# EAGLE design badge2016 (EAGLE 7.5.0)
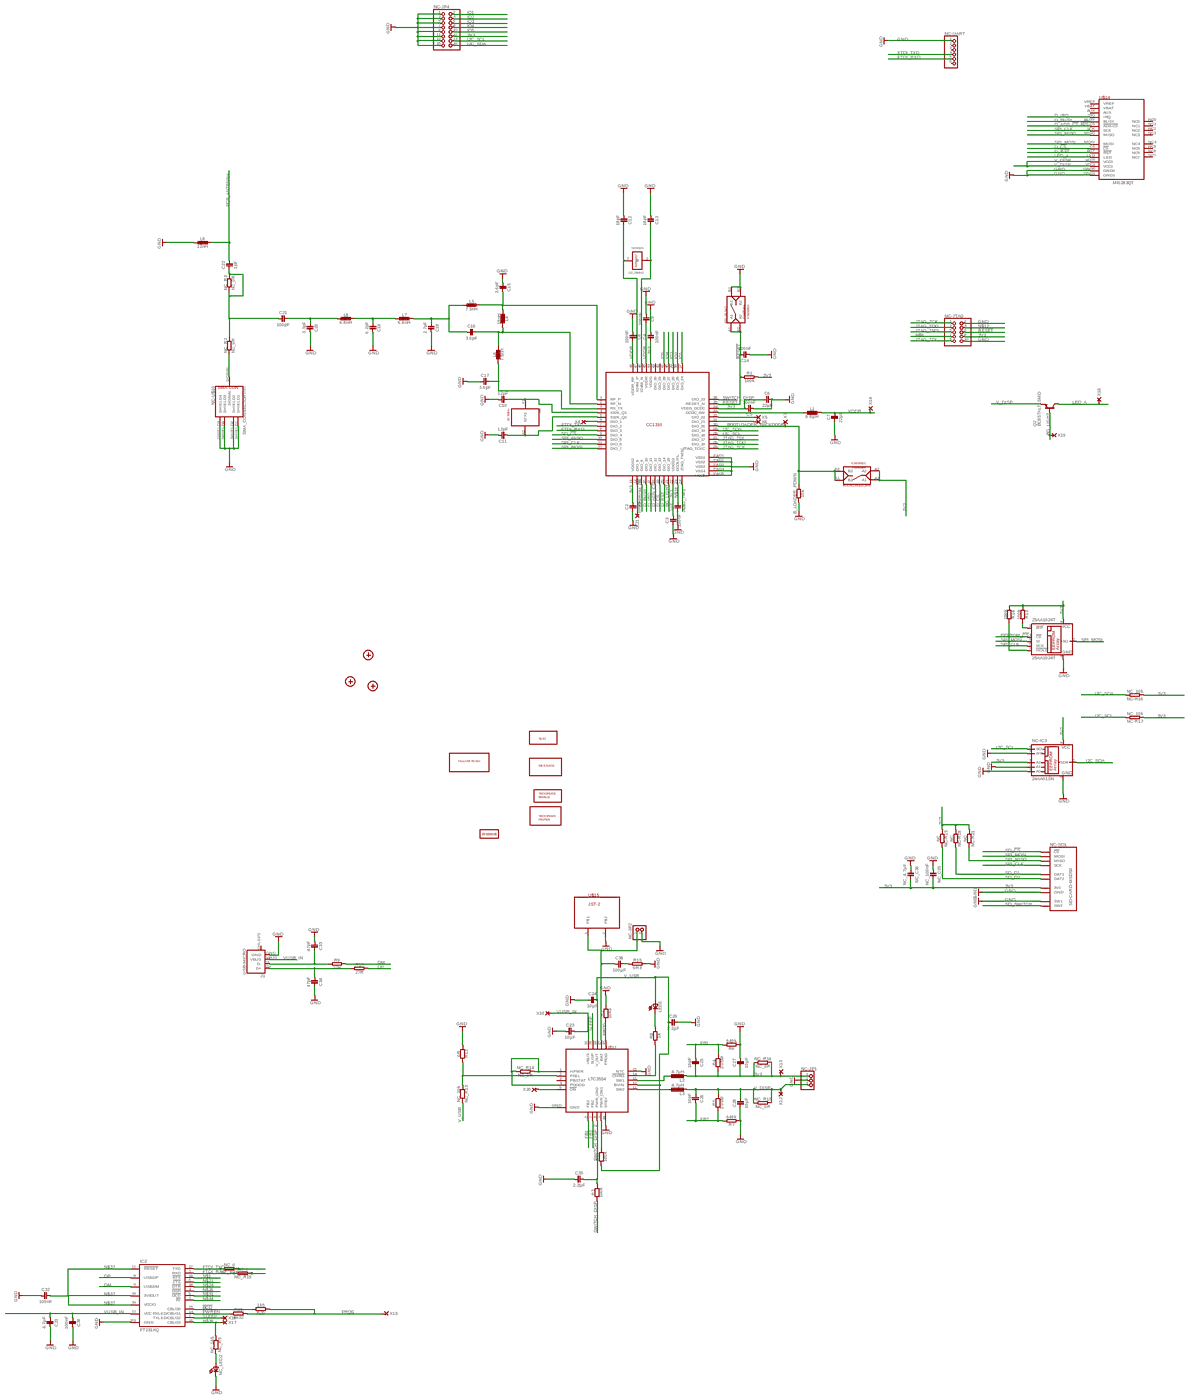
[diagram p0: schematic, sheet 1, overview]
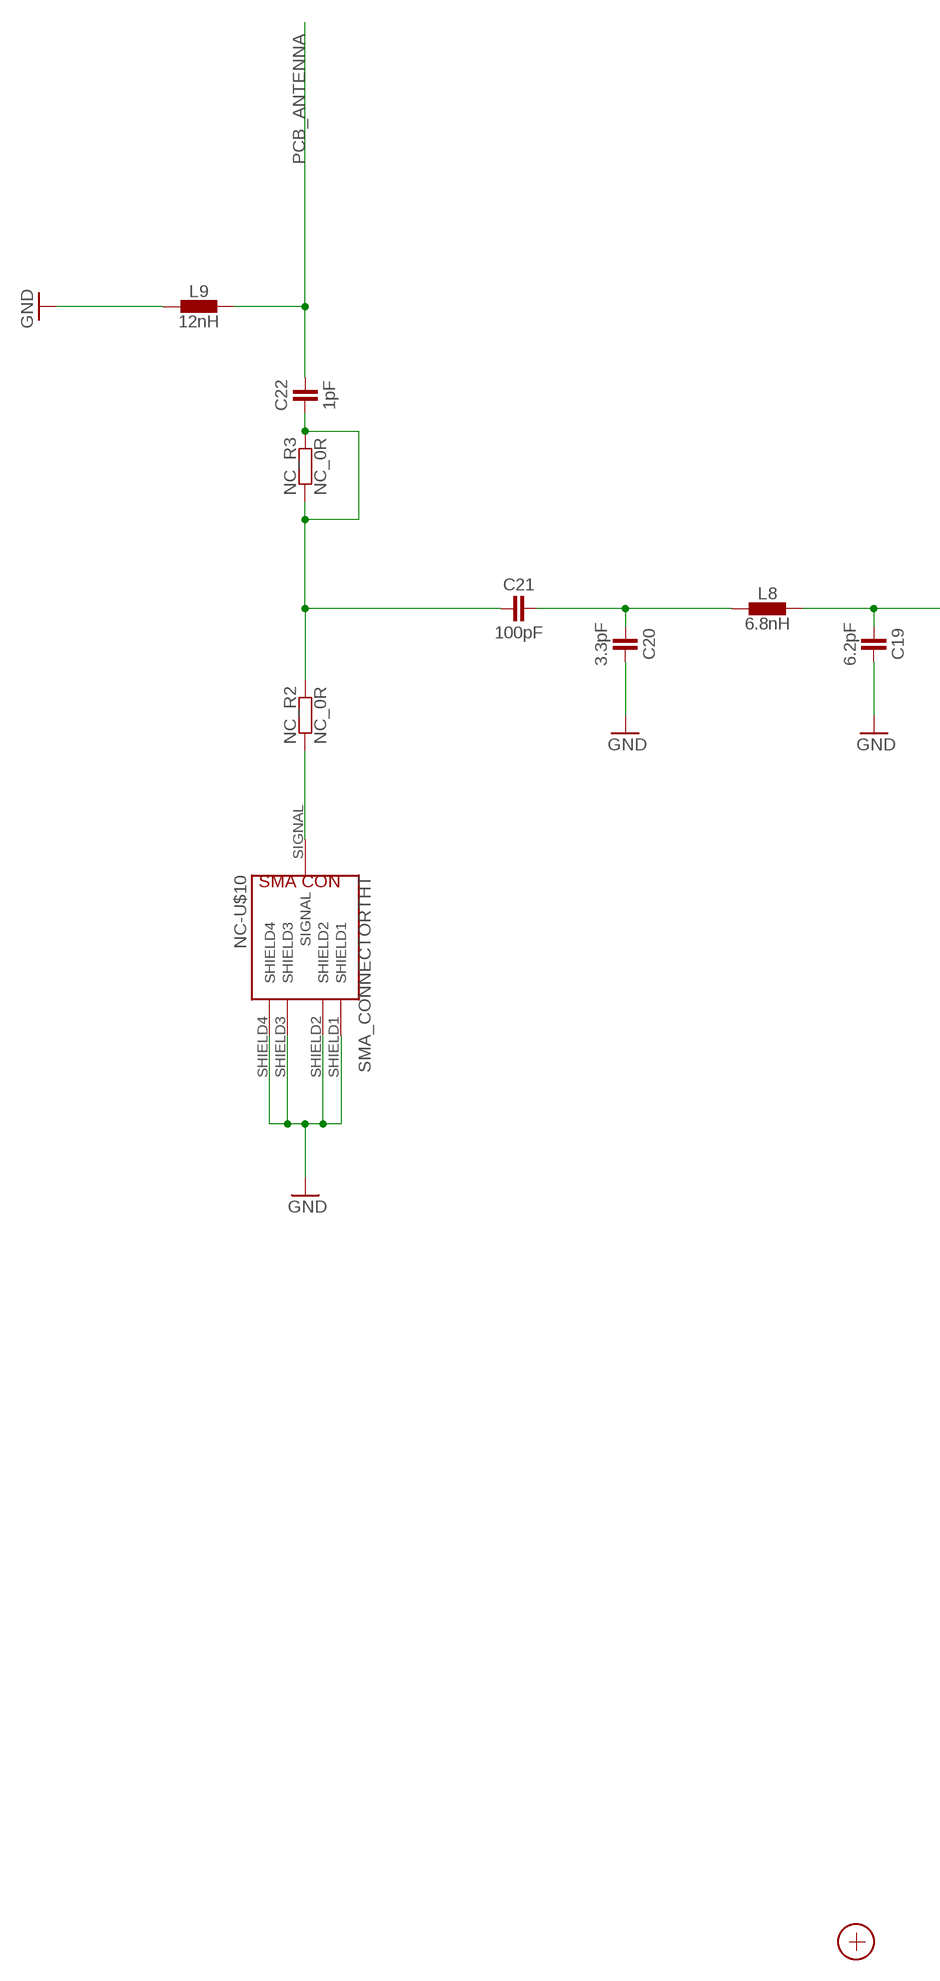
[diagram p1: schematic, sheet 1, part 1 of 4]
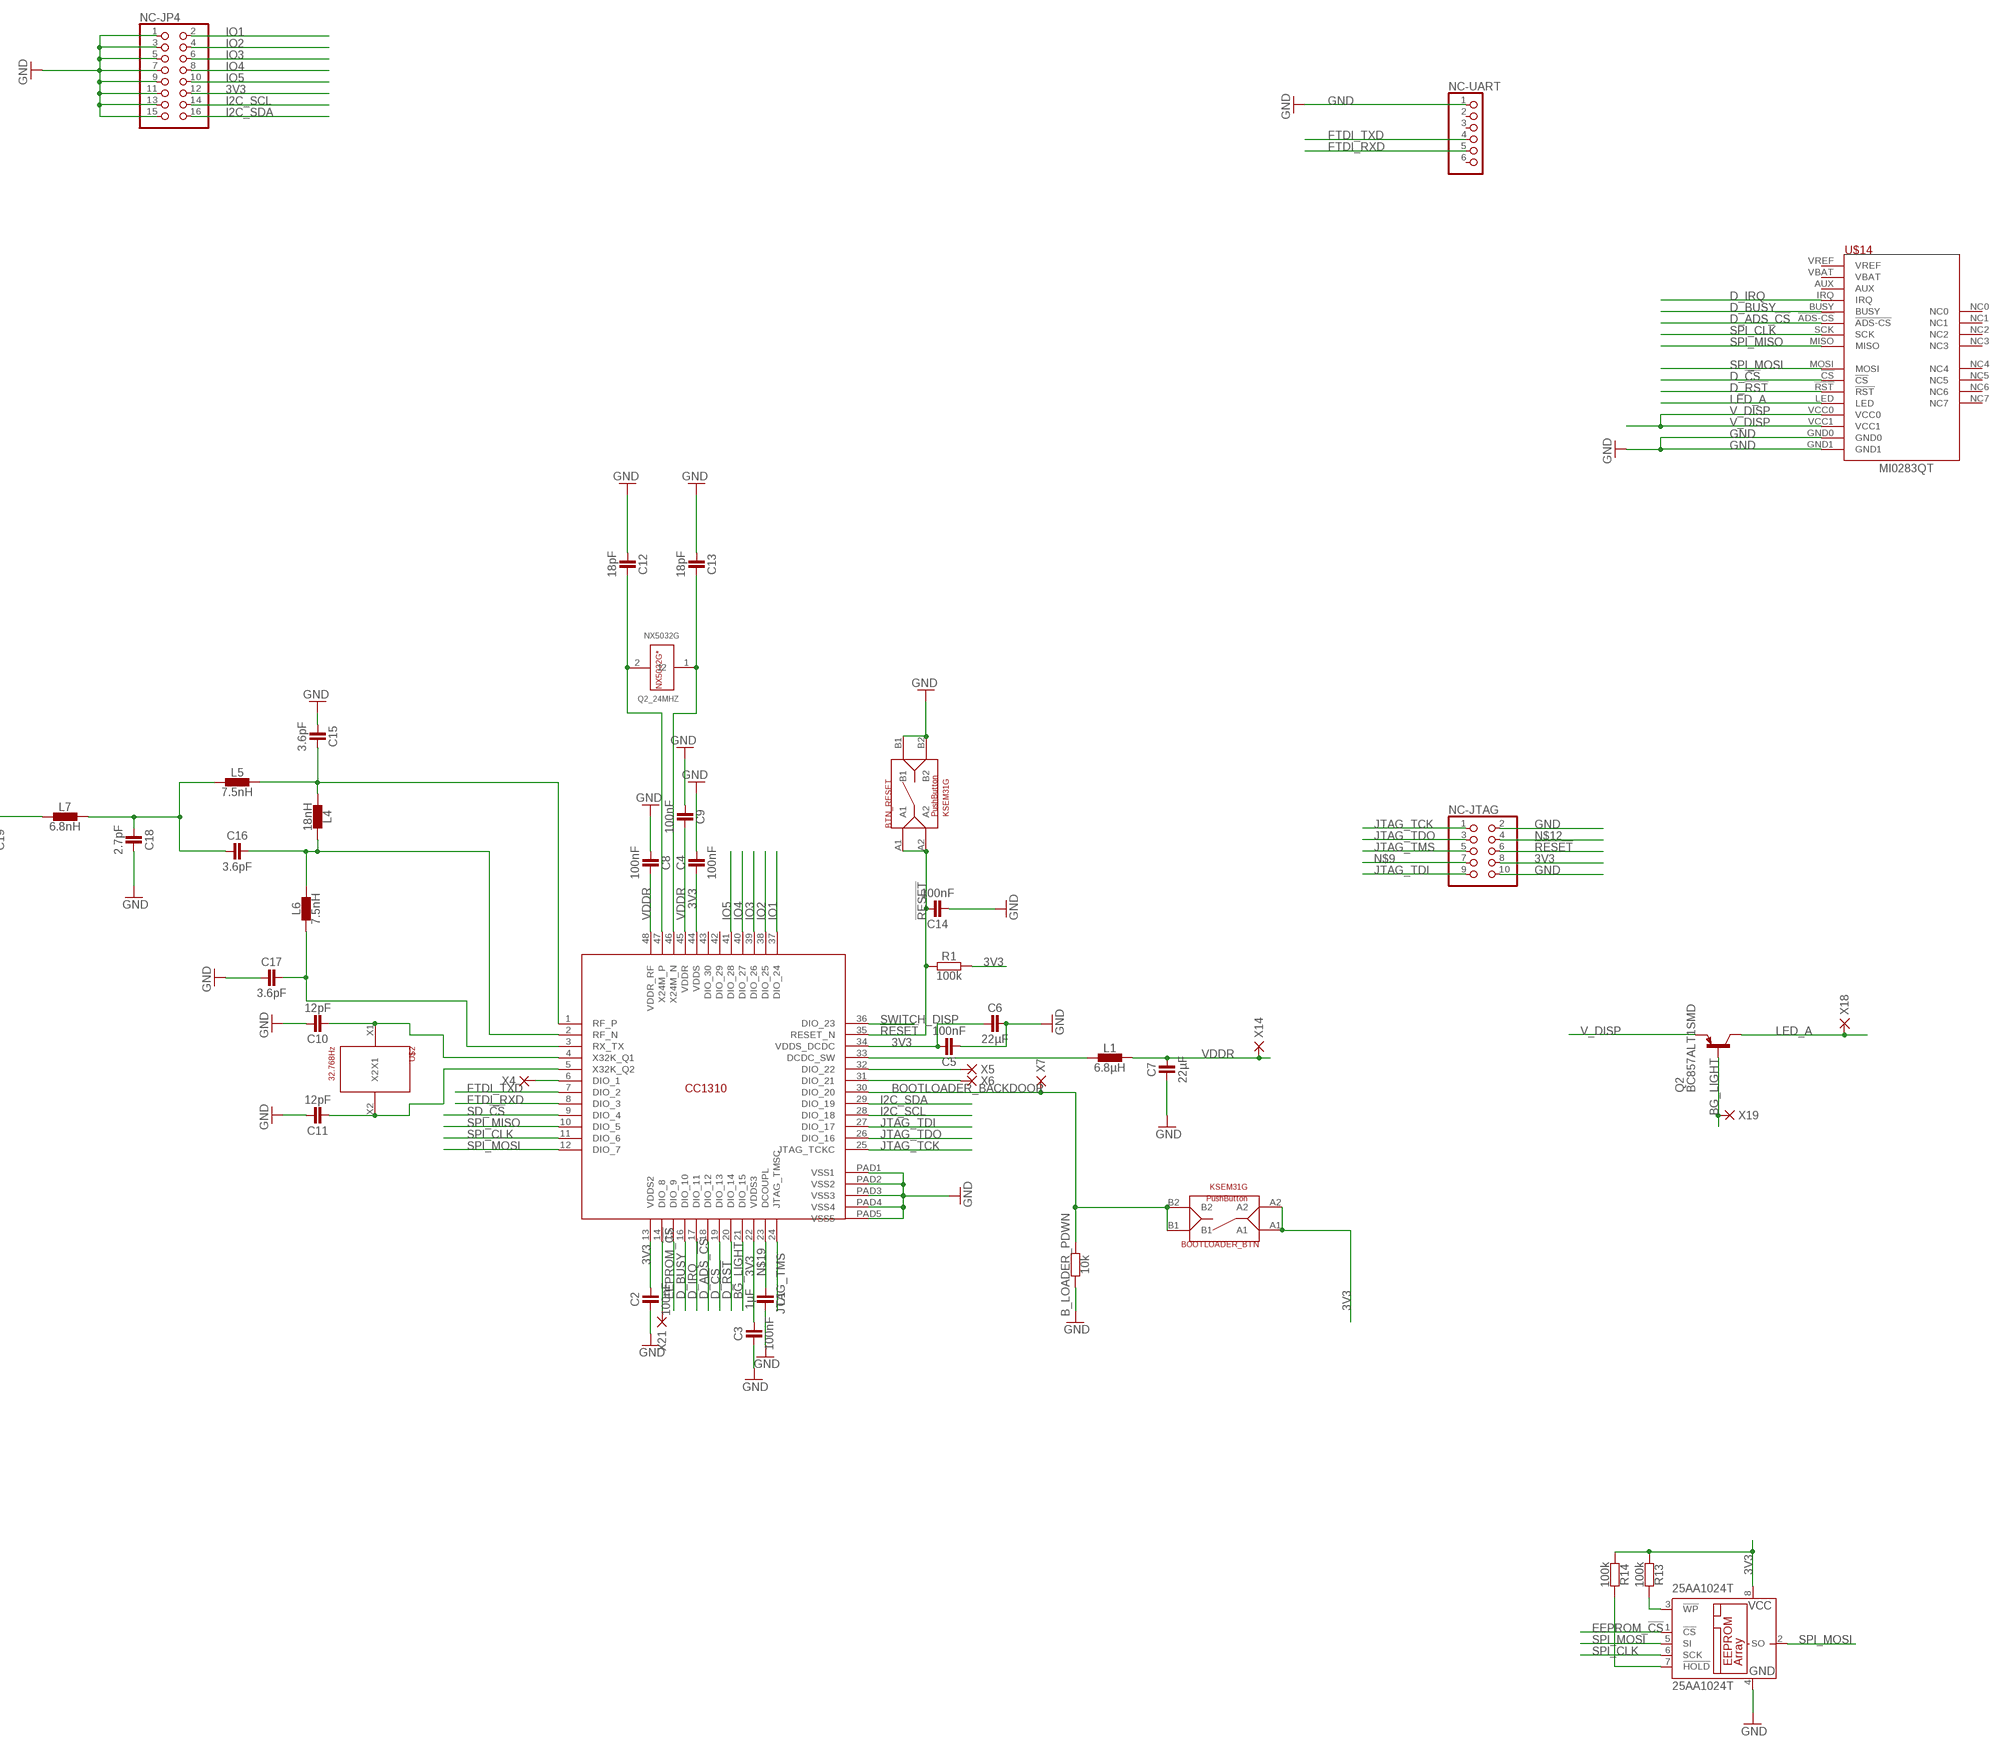
[diagram p2: schematic, sheet 1, part 2 of 4]
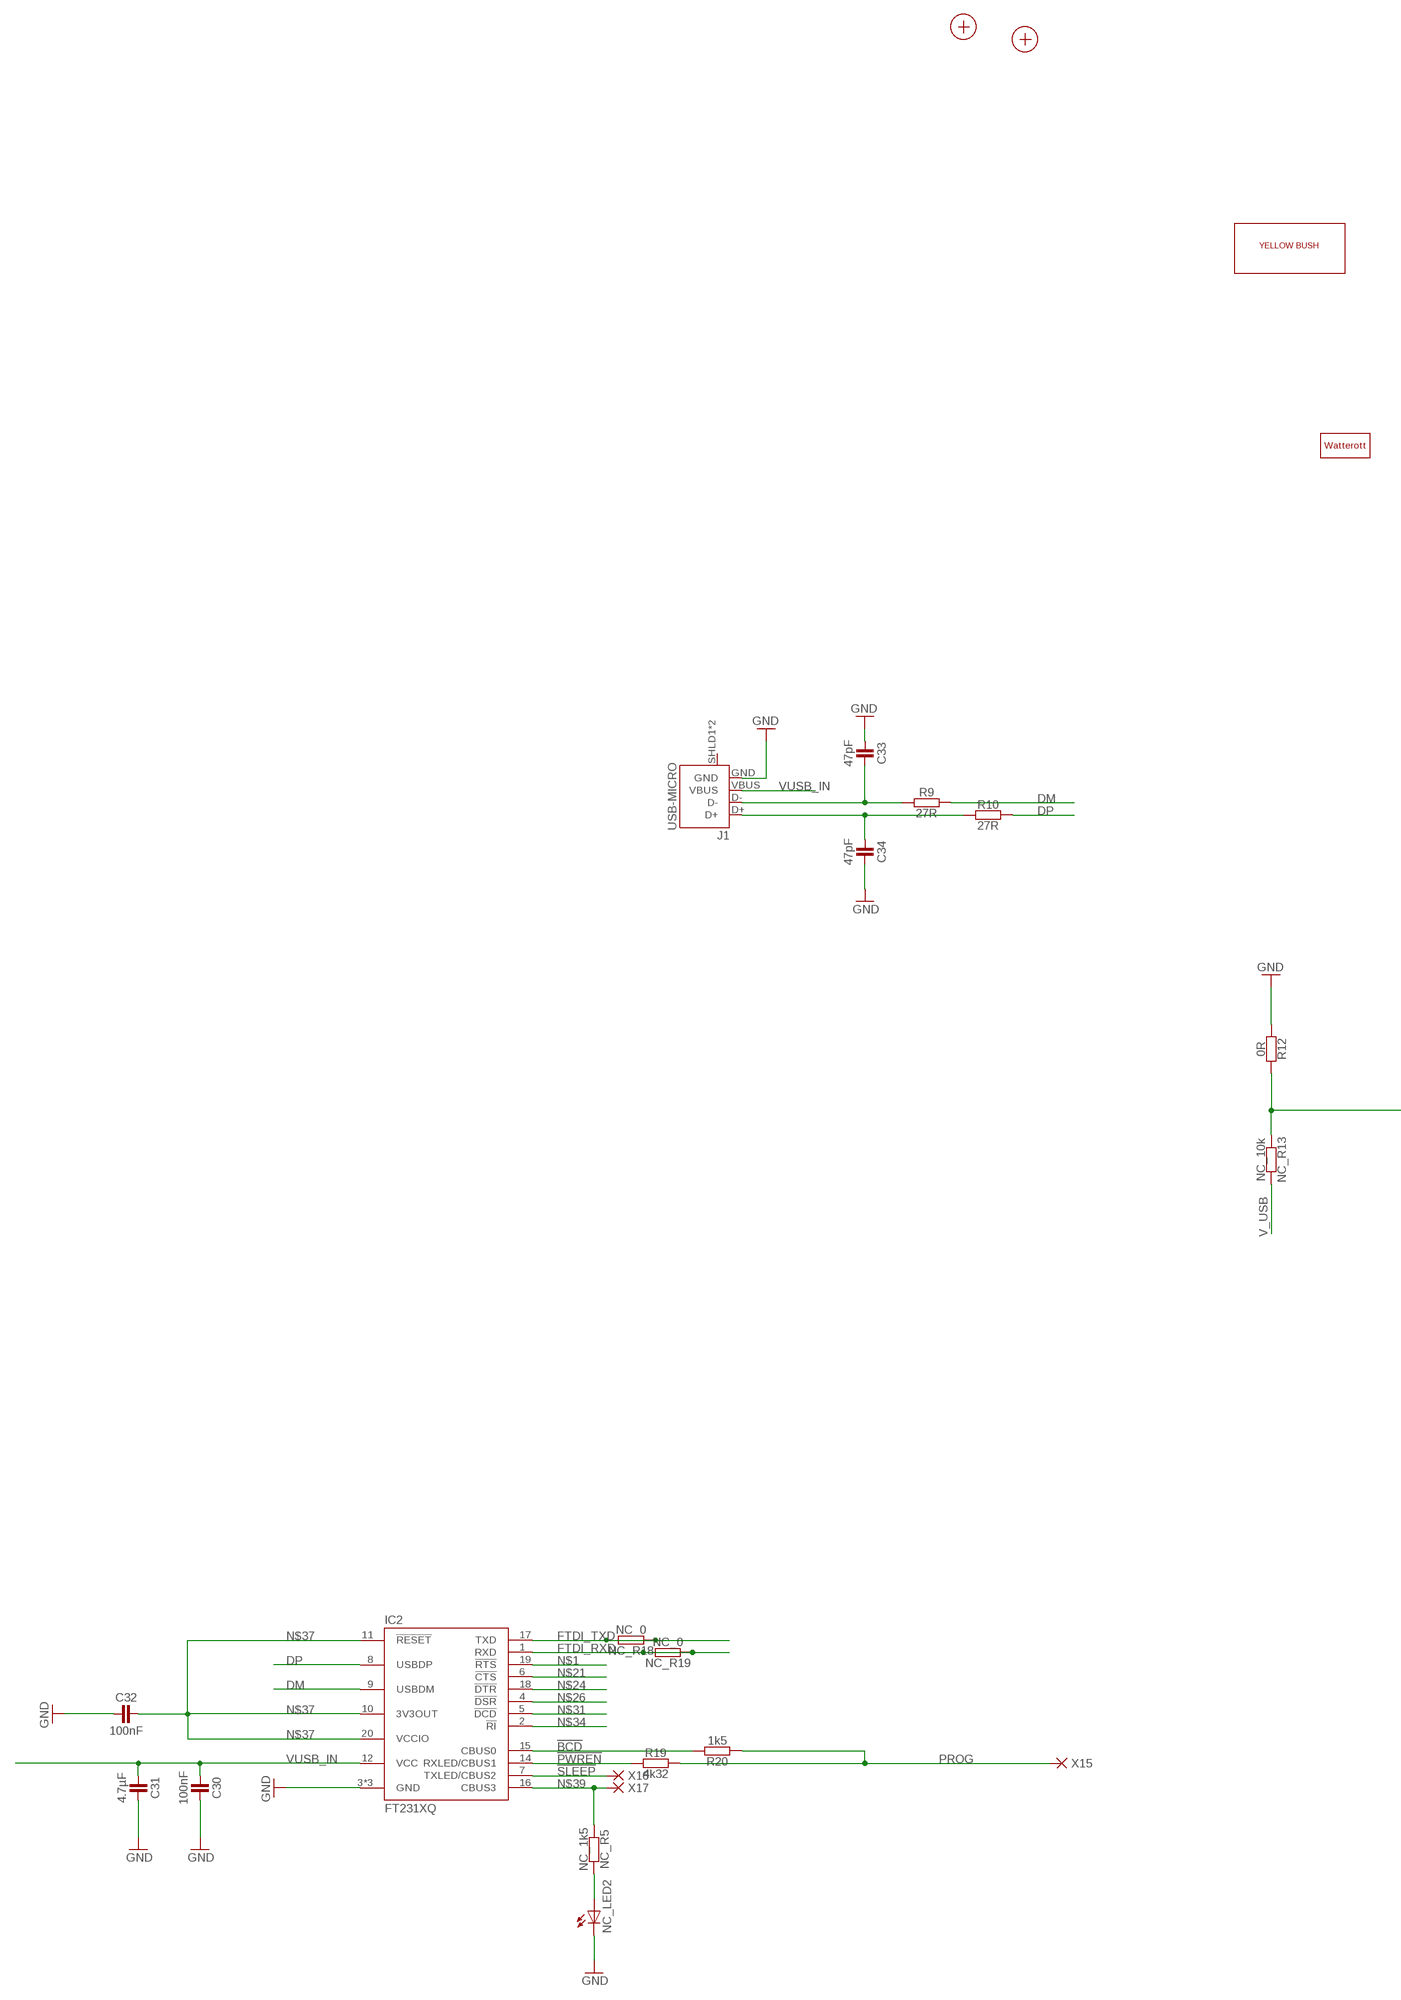
[diagram p3: schematic, sheet 1, part 3 of 4]
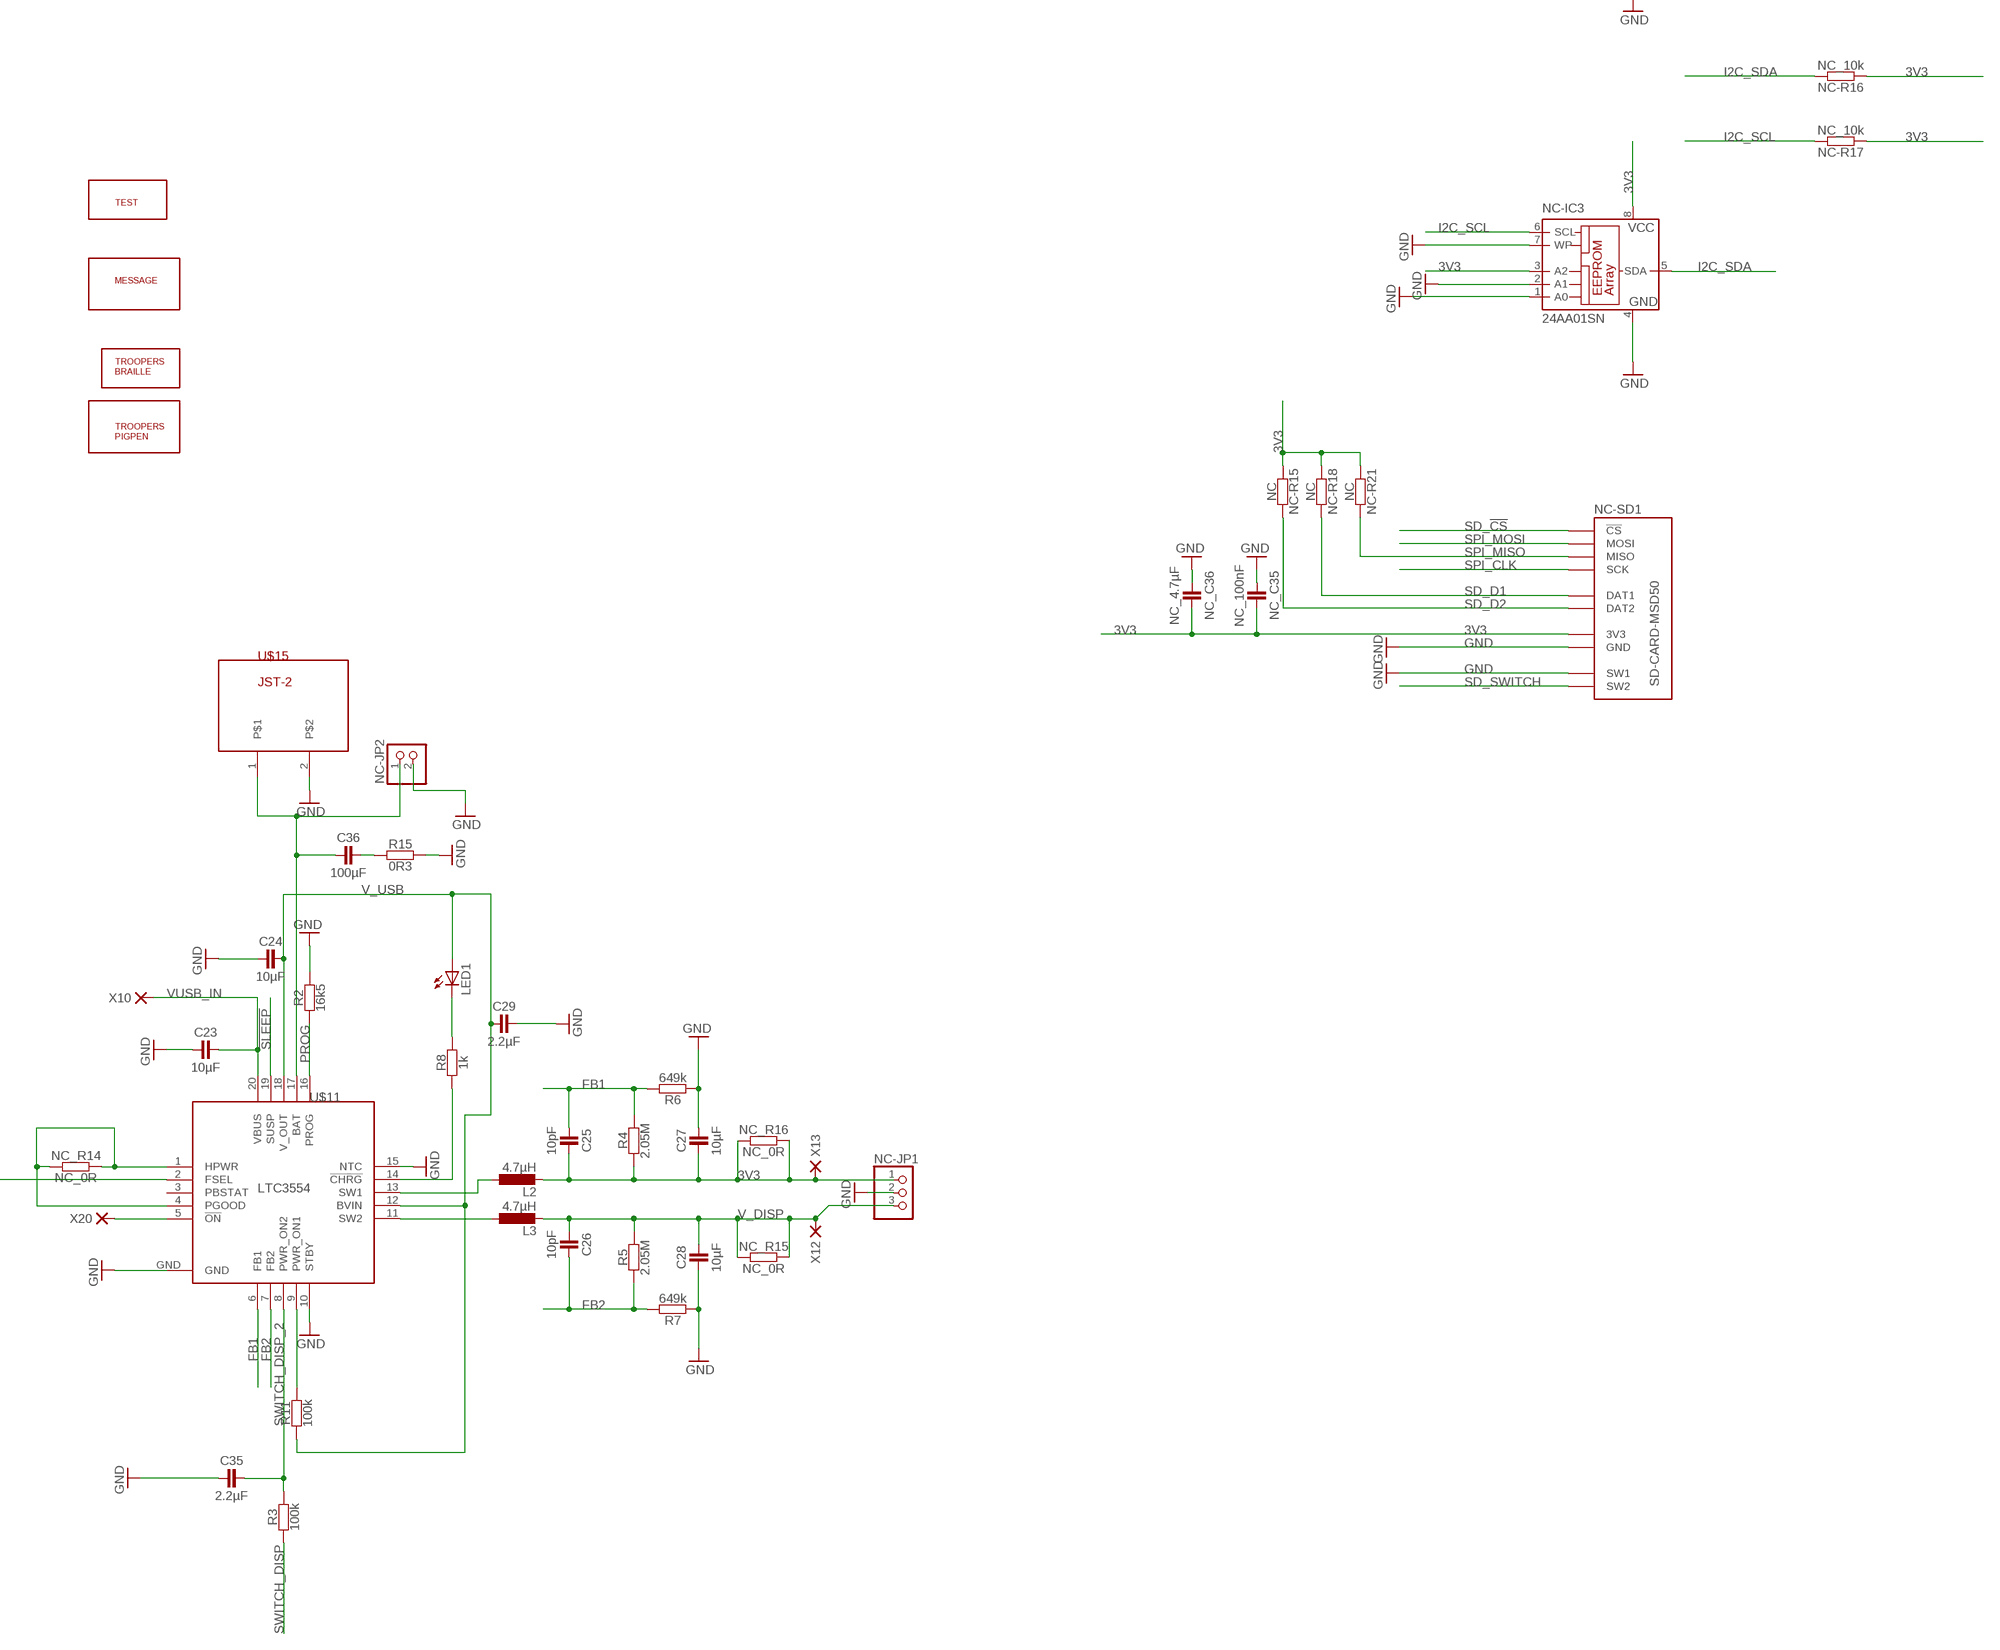
[diagram p4: schematic, sheet 1, part 4 of 4]

## Parts
25AA1024T  25AA1024T  25AA080SN  [SO-08]
B_LOADER_PDWN  10k  RESISTOR-0402  [C0402]
BOOTLOADER_BTN  KSEM31G  [KSEM31G]
BTN_RESET  KSEM31G  [KSEM31G]
C1  1µF  CAPACITOR-0402  [C0402]
C2  100nF  CAPACITOR-0402  [C0402]
C3  100nF  CAPACITOR-0402  [C0402]
C4  100nF  CAPACITOR-0402  [C0402]
C5  100nF  CAPACITOR-0402  [C0402]
C6  22µF  CAPACITOR-0603  [C0603]
C7  22µF  CAPACITOR-0603  [C0603]
C8  100nF  CAPACITOR-0402  [C0402]
C9  100nF  CAPACITOR-0402  [C0402]
C10  12pF  CAPACITOR-0402  [C0402]
C11  12pF  CAPACITOR-0402  [C0402]
C12  18pF  CAPACITOR-0402  [C0402]
C13  18pF  CAPACITOR-0402  [C0402]
C14  100nF  CAPACITOR-0402  [C0402]
C15  3.6pF  CAPACITOR-0402  [C0402]
C16  3.6pF  CAPACITOR-0402  [C0402]
C17  3.6pF  CAPACITOR-0402  [C0402]
C18  2.7pF  CAPACITOR-0402  [C0402]
C19  6.2pF  CAPACITOR-0402  [C0402]
C20  3.3pF  CAPACITOR-0402  [C0402]
C21  100pF  CAPACITOR-0402  [C0402]
C22  1pF  CAPACITOR-0402  [C0402]
C23  10µF  CAPACITOR-0805  [C0805]
C24  10µF  CAPACITOR-0805  [C0805]
C25  10pF  CAPACITOR-0402  [C0402]
C26  10pF  CAPACITOR-0402  [C0402]
C27  10µF  CAPACITOR-0805  [C0805]
C28  10µF  CAPACITOR-0805  [C0805]
C29  2.2µF  CAPACITOR-0603  [C0603]
C30  100nF  CAPACITOR-0402  [C0402]
C31  4.7µF  CAPACITOR-0402  [C0402]
C32  100nF  CAPACITOR-0402  [C0402]
C33  47pF  CAPACITOR-0402  [C0402]
C34  47pF  CAPACITOR-0402  [C0402]
C35  2.2µF  CAPACITOR-0603  [C0603]
C36  100µF  CAPACITOR-1206  [C1206]
IC2  FT231XQ  [QFN20-PAD]
J1  USB-MICRO  [USB-MICRO-10103594]
L1  6.8µH  INDUCTOR-0603  [C0603]
L2  4.7µH  L-EUL1812  [L1812]
L3  4.7µH  L-EUL1812  [L1812]
L4  18nH  INDUCTOR-0402  [C0402]
L5  7.5nH  INDUCTOR-0402  [C0402]
L6  7.5nH  INDUCTOR-0402  [C0402]
L7  6.8nH  INDUCTOR-0402  [C0402]
L8  6.8nH  INDUCTOR-0402  [C0402]
L9  12nH  INDUCTOR-0402  [C0402]
LED1  LED-0603  [C0603]
LOGO1  LOGO-S_LAYER  [SPARK_TOP]
NC-IC3  24AA01SN  [SO-08]
NC-JP1  PINHD-1X3  [1X03]
NC-JP2  PINHD-1X2  [1X02]
NC-JP4  PINHD-2X8  [2X08]
NC-JTAG  PINHD-2X5  [2X05]
NC-R15  NC  RESISTOR-0402  [C0402]
NC-R16  NC_10k  RESISTOR-0402  [C0402]
NC-R17  NC_10k  RESISTOR-0402  [C0402]
NC-R18  NC  RESISTOR-0402  [C0402]
NC-R21  NC  RESISTOR-0402  [C0402]
NC-SD1  SD-CARD-MSD50  [SD_5031821853]
NC-U$10  SMA_CONNECTORTHT  [SMA_CON_THT]
NC-UART  PINHD-1X6  [1X06]
NC_C35  NC_100nF  CAPACITOR-0402  [C0402]
NC_C36  NC_4.7µF  CAPACITOR-0402  [C0402]
NC_LED2  LED-0603  [C0603]
NC_R2  NC_0R  RESISTOR-0603  [C0603]
NC_R3  NC_0R  RESISTOR-0603  [C0603]
NC_R5  NC_1k5  RESISTOR-0402  [C0402]
NC_R13  NC_10k  RESISTOR-0402  [C0402]
NC_R14  NC_0R  RESISTOR-0402  [C0402]
NC_R15  NC_0R  RESISTOR-0603  [C0603]
NC_R16  NC_0R  RESISTOR-0603  [C0603]
NC_R18  NC_0  RESISTOR-0402  [C0402]
NC_R19  NC_0  RESISTOR-0402  [C0402]
Q2  BC857ALT1SMD  [SOT23-BEC]
Q2_24MHZ  NX5032G  [NX5032G*]
R1  100k  RESISTOR-0402  [C0402]
R2  16k5  RESISTOR-0402  [C0402]
R3  100k  RESISTOR-0402  [C0402]
R4  2.05M  RESISTOR-0402  [C0402]
R5  2.05M  RESISTOR-0402  [C0402]
R6  649k  RESISTOR-0402  [C0402]
R7  649k  RESISTOR-0402  [C0402]
R8  1k  RESISTOR-0402  [C0402]
R9  27R  RESISTOR-0402  [C0402]
R10  27R  RESISTOR-0402  [C0402]
R11  100k  RESISTOR-0402  [C0402]
R12  0R  RESISTOR-0402  [C0402]
R13  100k  RESISTOR-0402  [C0402]
R14  100k  RESISTOR-0402  [C0402]
R15  0R3  RESISTOR-0402  [C0402]
R19  4k32  RESISTOR-0402  [C0402]
R20  1k5  RESISTOR-0402  [C0402]
U$1  CC1310  [S-PVQFN-N48]
U$2  32.768Hz  CMR200T  [CMR200T]
U$3  BB_TEST  [BB_TEST]
U$4  MESSAGE  [MESSAGE]
U$5  TR_BRAILLE  [TR_BRAILLE]
U$6  TR_PIGPEN  [TR_PIGPEN]
U$7  YELLOW_BUSH  [YELLOW_BUSH]
U$11  LTC3554  [QFN-20-3X3]
U$14  MI0283QT  [MI0283QT]
U$15  JST-2  [JST-2]
X1  PASSER-07  [PASSER_07MM]
X2  PASSER-07  [PASSER_07MM]
X3  PASSER-07  [PASSER_07MM]
X4  PAD-0.5  [PAD-0.5]
X5  PAD-0.5  [PAD-0.5]
X6  PAD-0.5  [PAD-0.5]
X7  PAD-0.5  [PAD-0.5]
X10  PAD-1.27X1.27  [PAD-1.27X1.27]
X12  PAD-1.27X1.27  [PAD-1.27X1.27]
X13  PAD-1.27X1.27  [PAD-1.27X1.27]
X14  PAD-1.27X1.27  [PAD-1.27X1.27]
X15  PAD-1.27X1.27  [PAD-1.27X1.27]
X16  PAD-1.27X1.27  [PAD-1.27X1.27]
X17  PAD-1.27X1.27  [PAD-1.27X1.27]
X18  PAD-1.27X1.27  [PAD-1.27X1.27]
X19  PAD-1.27X1.27  [PAD-1.27X1.27]
X20  PAD-1.27X1.27  [PAD-1.27X1.27]
X21  PAD-0.5  [PAD-0.5]

## Nets
3V3: 25AA1024T.8(VCC) BOOTLOADER_BTN.A1 BOOTLOADER_BTN.A2 C2.2 C3.2 C4.1 C5.2 C6.1 C25.2 C27.1 L2.2 NC-IC3.3(A2) NC-IC3.8(VCC) NC-JP1.1 NC-JP4.12 NC-JTAG.8 NC-R15.1 NC-R16.1 NC-R17.1 NC-R18.1 NC-R21.1 NC-SD1.VCC(3V3) NC_C35.2 NC_C36.2 NC_R16.1 NC_R16.2 R1.2 R4.1 R13.1 R14.1 U$1.13(VDDS2) U$1.22(VDDS3) U$1.34(VDDS_DCDC) U$1.44(VDDS) X13.1(P)
!BCD: IC2.15(CBUS0) R20.2
!PWREN: IC2.14(RXLED/CBUS1) R19.1
!RESET: BTN_RESET.A1 BTN_RESET.A2 C14.2 NC-JTAG.6 R1.1 U$1.35(RESET_N)
!SLEEP: IC2.7(TXLED/CBUS2) U$11.19(SUSP) X16.1(P)
BG_LIGHT: Q2.B U$1.21(DIO_15) X19.1(P)
BOOTLOADER_BACKDOOR: B_LOADER_PDWN.2 BOOTLOADER_BTN.B1 BOOTLOADER_BTN.B2 U$1.30(DIO_20) X7.1(P)
D_!CS: U$1.19(DIO_13) U$14.!CS
D_!RST: U$1.20(DIO_14) U$14.!RST
D_ADS_!CS: U$1.18(DIO_12) U$14.!ADS-CS
D_BUSY: U$1.16(DIO_10) U$14.BUSY
D_IRQ: U$1.17(DIO_11) U$14.IRQ
DM: IC2.9(USBDM) R9.2
DP: IC2.8(USBDP) R10.2
EEPROM_!CS: 25AA1024T.1(!CS) U$1.15(DIO_9)
FB1: C25.1 R4.2 R6.2 U$11.6(FB1)
FB2: C26.2 R5.1 R7.2 U$11.7(FB2)
FTDI_RXD: IC2.1(RXD) NC-UART.5 NC_R19.1 NC_R19.2 U$1.8(DIO_3)
FTDI_TXD: IC2.17(TXD) NC-UART.4 NC_R18.1 NC_R18.2 U$1.7(DIO_2)
GND: 25AA1024T.4(GND) B_LOADER_PDWN.1 BTN_RESET.B1 BTN_RESET.B2 C1.2 C2.1 C3.1 C4.2 C5.1 C6.2 C7.1 C8.1 C9.1 C10.2 C11.2 C12.1 C13.1 C14.1 C15.1 C17.1 C18.2 C19.2 C20.2 C23.1 C24.1 C27.2 C28.1 C29.2 C30.2 C31.2 C32.1 C33.1 C34.2 C35.1 IC2.3(GND) IC2.13(GND) IC2.TP(GND) J1.GND L9.1 NC-IC3.1(A0) NC-IC3.2(A1) NC-IC3.4(GND) NC-IC3.7(WP) NC-JP1.2 NC-JP2.2 NC-JP4.1 NC-JP4.3 NC-JP4.5 NC-JP4.7 NC-JP4.9 NC-JP4.11 NC-JP4.13 NC-JP4.15 NC-JTAG.2 NC-JTAG.10 NC-SD1.GND NC-SD1.SW1 NC-U$10.SHIELD1 NC-U$10.SHIELD2 NC-U$10.SHIELD3 NC-U$10.SHIELD4 NC-UART.1 NC_C35.1 NC_C36.1 NC_LED2.C R2.2 R6.1 R7.1 R12.1 R15.2 U$1.PAD1(VSS1) U$1.PAD2(VSS2) U$1.PAD3(VSS3) U$1.PAD4(VSS4) U$1.PAD5(VSS5) U$11.10(STBY) U$11.15(NTC) U$11.GND U$14.GND0 U$14.GND1 U$15.2
I2C_SCL: NC-IC3.6(SCL) NC-JP4.14 NC-R17.2 U$1.28(DIO_18)
I2C_SDA: NC-IC3.5(SDA) NC-JP4.16 NC-R16.2 U$1.29(DIO_19)
IO1: NC-JP4.2 U$1.37(DIO_24)
IO2: NC-JP4.4 U$1.38(DIO_25)
IO3: NC-JP4.6 U$1.39(DIO_26)
IO4: NC-JP4.8 U$1.40(DIO_27)
IO5: NC-JP4.10 U$1.41(DIO_28)
JTAG_TCK: NC-JTAG.1 U$1.25(JTAG_TCKC)
JTAG_TDI: NC-JTAG.9 U$1.27(DIO_17)
JTAG_TDO: NC-JTAG.3 U$1.26(DIO_16)
JTAG_TMS: NC-JTAG.5 U$1.24(JTAG_TMSC)
LED_A: Q2.C U$14.LED X18.1(P)
N$1: IC2.19(!RTS)
N$2: C10.1 U$1.4(X32K_Q1) U$2.X1
N$3: L1.1 U$1.33(DCDC_SW)
N$4: C12.2 Q2_24MHZ.2 U$1.47(X24M_P)
N$5: C13.2 Q2_24MHZ.1 U$1.46(X24M_N)
N$6: C16.2 L4.2 L6.2 U$1.2(RF_N)
N$7: C15.2 L4.1 L5.2 U$1.1(RF_P)
N$8: C16.1 C18.1 L5.1 L7.2
N$9: NC-JTAG.7
N$10: C17.2 L6.1 U$1.3(RX_TX)
N$11: C19.1 L7.1 L8.2
N$12: NC-JTAG.4
N$13: C20.1 C21.2 L8.1
N$14: U$1.6(DIO_1) X4.1(P)
N$15: C21.1 C22.1 NC_R2.2 NC_R3.1 NC_R3.2
N$16: C11.1 U$1.5(X32K_Q2) U$2.X2
N$17: NC-U$10.SIGNAL NC_R2.1
N$18: L3.1 U$11.11(SW2)
N$19: C1.1 U$1.23(DCOUPL)
N$20: C36.1 NC-JP2.1 U$11.17(BAT) U$15.1
N$21: IC2.6(!CTS)
N$22: NC_R13.1 R12.2 U$11.2(FSEL)
N$23: L2.1 U$11.13(SW1)
N$24: IC2.18(!DTR)
N$25: C34.1 J1.D+ R10.1
N$26: IC2.4(!DSR)
N$27: R8.1 U$11.14(!CHRG)
N$28: LED1.C R8.2
N$29: R11.2 U$11.9(PWR_ON1)
N$30: NC_R14.1 NC_R14.2 U$11.1(HPWR) U$11.4(PGOOD)
N$31: IC2.5(!DCD)
N$32: C33.2 J1.D- R9.1
N$33: 25AA1024T.7(!HOLD) R14.2
N$34: IC2.2(!RI)
N$35: U$1.32(DIO_22) X5.1(P)
N$36: U$1.31(DIO_21) X6.1(P)
N$37: C32.2 IC2.10(3V3OUT) IC2.11(!RESET) IC2.20(VCCIO)
N$38: 25AA1024T.3(!WP) R13.2
N$39: IC2.16(CBUS3) NC_R5.1 X17.1(P)
N$40: NC_LED2.A NC_R5.2
N$41: U$11.5(!ON) X20.1(P)
N$53: U$1.14(DIO_8) X21.1(P)
N$54: C36.2 R15.1
PCB_ANTENNA: C22.2 L9.2
PROG: R2.1 R19.2 R20.1 U$11.16(PROG) X15.1(P)
SD_!CS: NC-SD1.CS(!CS) U$1.9(DIO_4)
SD_D1: NC-R18.2 NC-SD1.DAT1
SD_D2: NC-R15.2 NC-SD1.DAT2
SD_SWITCH: NC-SD1.SW2
SPI_CLK: 25AA1024T.6(SCK) NC-SD1.SCK U$1.11(DIO_6) U$14.SCK
SPI_MISO: NC-R21.2 NC-SD1.MISO U$1.10(DIO_5) U$14.MISO
SPI_MOSI: 25AA1024T.2(SO) 25AA1024T.5(SI) NC-SD1.MOSI U$1.12(DIO_7) U$14.MOSI
SWITCH_DISP: R3.1 U$1.36(DIO_23)
SWITCH_DISP_2: C35.2 R3.2 U$11.8(PWR_ON2)
V_DISP: C26.1 C28.2 L3.2 NC-JP1.3 NC_R15.1 NC_R15.2 Q2.E R5.2 U$14.VCC0 U$14.VCC1 X12.1(P)
V_USB: C24.2 C29.1 LED1.A NC_R13.2 R11.1 U$11.12(BVIN) U$11.18(V_OUT)
VDDR: C7.2 C8.2 C9.2 L1.2 U$1.45(VDDR) U$1.48(VDDR_RF) X14.1(P)
VUSB_IN: C23.2 C30.1 C31.1 IC2.12(VCC) J1.VBUS U$11.20(VBUS) X10.1(P)
Unconnected: J1.SHLD1(SHIELD) J1.SHLD2(SHIELD) NC-UART.2 NC-UART.3 NC-UART.6 U$1.42(DIO_29) U$1.43(DIO_30) U$11.3(PBSTAT) U$14.AUX U$14.NC0 U$14.NC1 U$14.NC2 U$14.NC3 U$14.NC4 U$14.NC5 U$14.NC6 U$14.NC7 U$14.VBAT U$14.VREF

## Library data of the parts
25AA1024T = microchip:25*: Serial EEPROM 4K/ 8K , SPI bus; MF: MICROCHIP; MPN: 25AA080/SN; OC_FARNELL: 1816072; OC_NEWARK: 92C7351
B_LOADER_PDWN NC-R15-NC-R18 NC-R21 NC_R2 NC_R3 NC_R5 NC_R13-NC_R16 NC_R18 NC_R19 R1-R15 R19 R20 = we-rcl:RESISTOR: Resistors all kinds in 0603 and 0402
BOOTLOADER_BTN BTN_RESET = ERNW_parts:KSEM31G
C1-C36 NC_C35 NC_C36 = we-rcl:CAPACITOR: Capacitors ...4.7uF @ 6.3V -> 0402 ...10uF @ 16V -> 0603 ...22uF @ 25V -> 0805
IC2 = we-chip:FT231X: FTDI FT231X USB to UART Bridge (5V tolerant inputs); DIGIKEY: 768-1128-6-ND
J1 = we-con:USB: USB Connectors; DIGIKEY: 609-4050-6-ND
L1 L4-L9 = we-rcl:INDUCTOR: Inductors
L2 L3 = rcl:L-EU: INDUCTOR, European symbol
LED1 NC_LED2 = we-opto:LED: LEDs
LOGO1 = we-symbol:LOGO: Watterott electronic Logo
NC-IC3 = microchip:24*: Serial EEPROM I2C; MF: MICROCHIP; MPN: 24AA01/SN; OC_FARNELL: 1331268; OC_NEWARK: 89C9792
NC-JP1 = pinhead:PINHD-1X3: PIN HEADER
NC-JP2 = pinhead:PINHD-1X2: PIN HEADER
NC-JP4 = pinhead:PINHD-2X8: PIN HEADER
NC-JTAG = pinhead:PINHD-2X5: PIN HEADER
NC-SD1 = we-con:SD-CARD: SD-Card Sockets; DIGIKEY: WM9750TR-ND
NC-U$10 = ERNW_parts:SMA_CONNECTOR: SMA CONNECTOR TE CONNECTIVITY SMA Str PCB Skt GZD 5-1814832-1 Digikey Docs
NC-UART = pinhead:PINHD-1X6: PIN HEADER
Q2 = transistor-pnp:BC857*: PNP Transistror
Q2_24MHZ = ERNW_parts:NX5032G*
U$1 = ERNW_parts:CC1310
U$2 = ERNW_parts:CMR200T
U$3 = ERNW_parts:BB_TEST
U$4 = ERNW_parts:MESSAGE
U$5 = ERNW_parts:TR_BRAILLE
U$6 = ERNW_parts:TR_PIGPEN
U$7 = ERNW_parts:YELLOW_BUSH
U$11 = ERNW_parts:LTC3554
U$14 = ERNW_parts:MI0283QT
U$15 = ERNW_parts:JST-2
X1-X3 = we-symbol:PASSER: Fiducial Markers
X4-X7 X10 X12-X21 = we-rcl:PAD: Pads

## Board
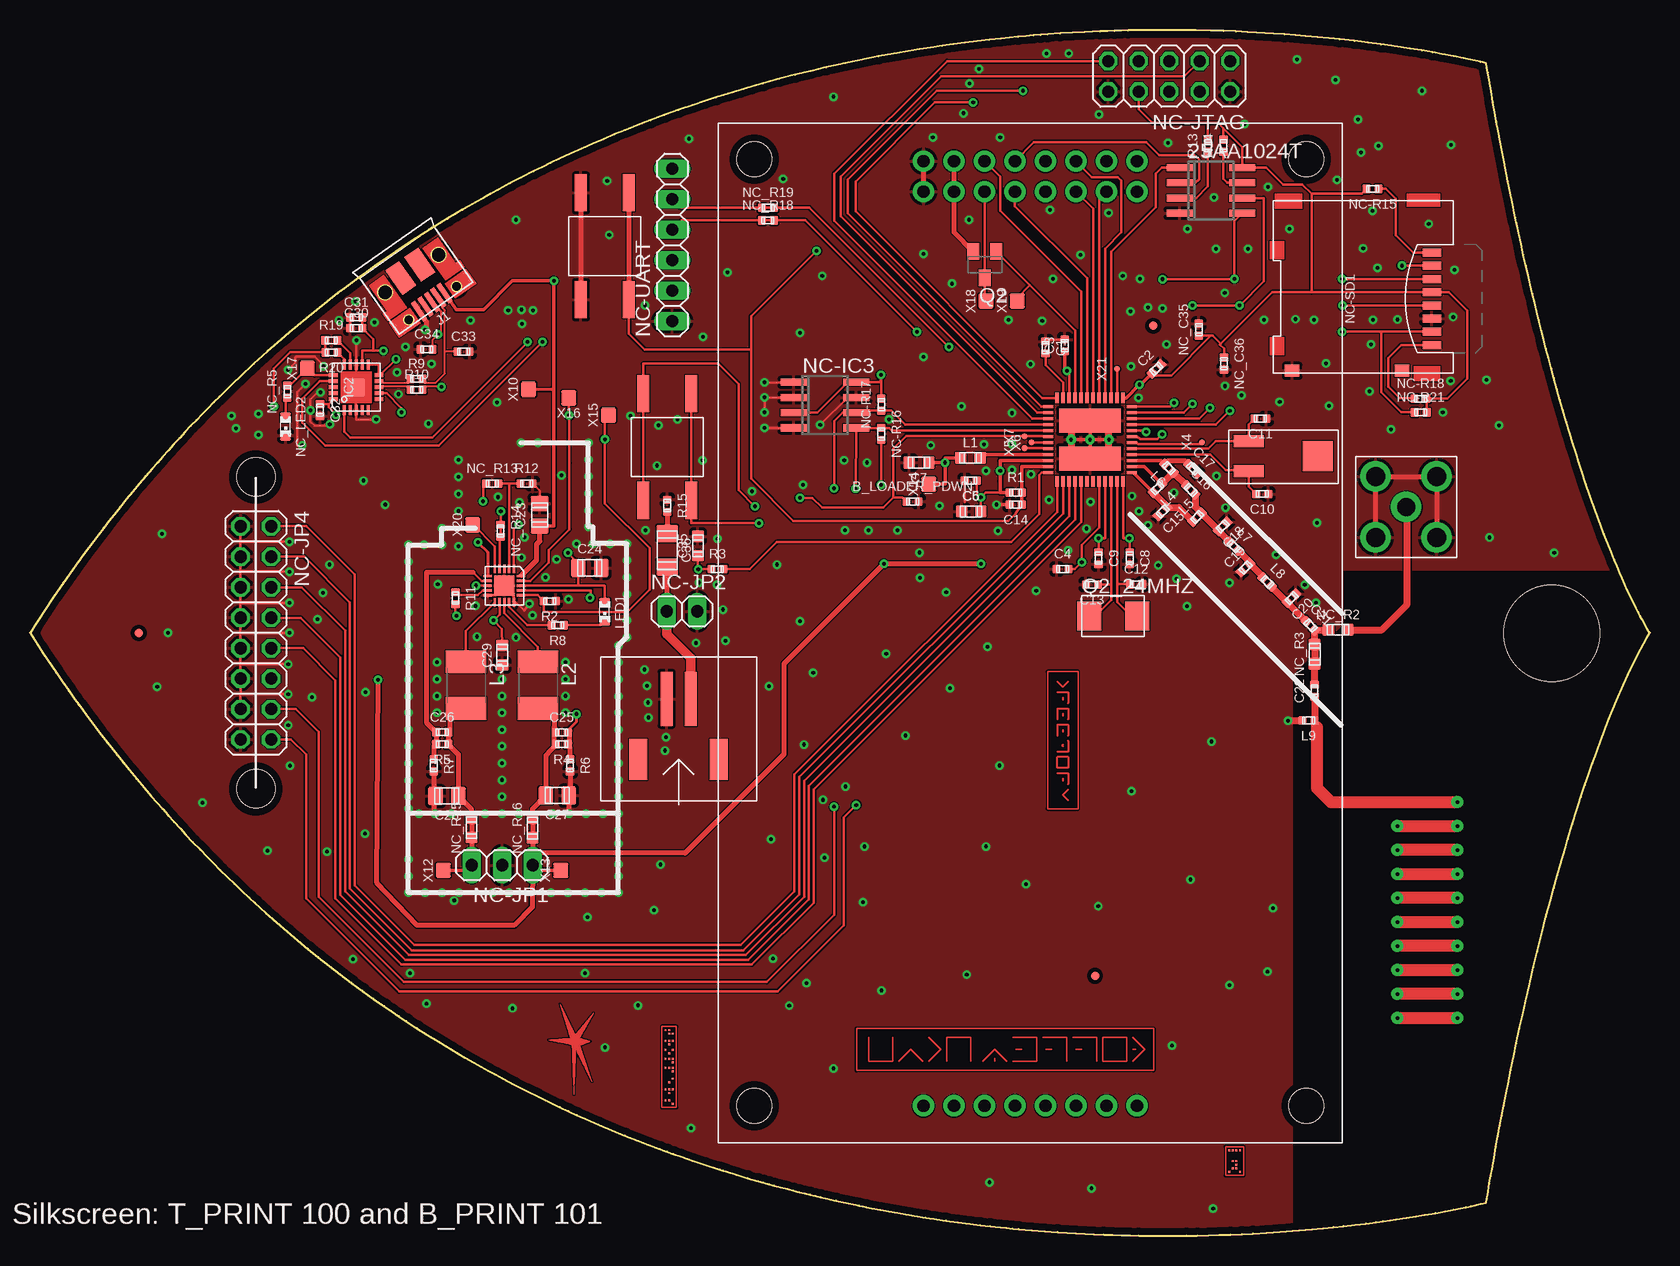
[diagram p5: board, top side]
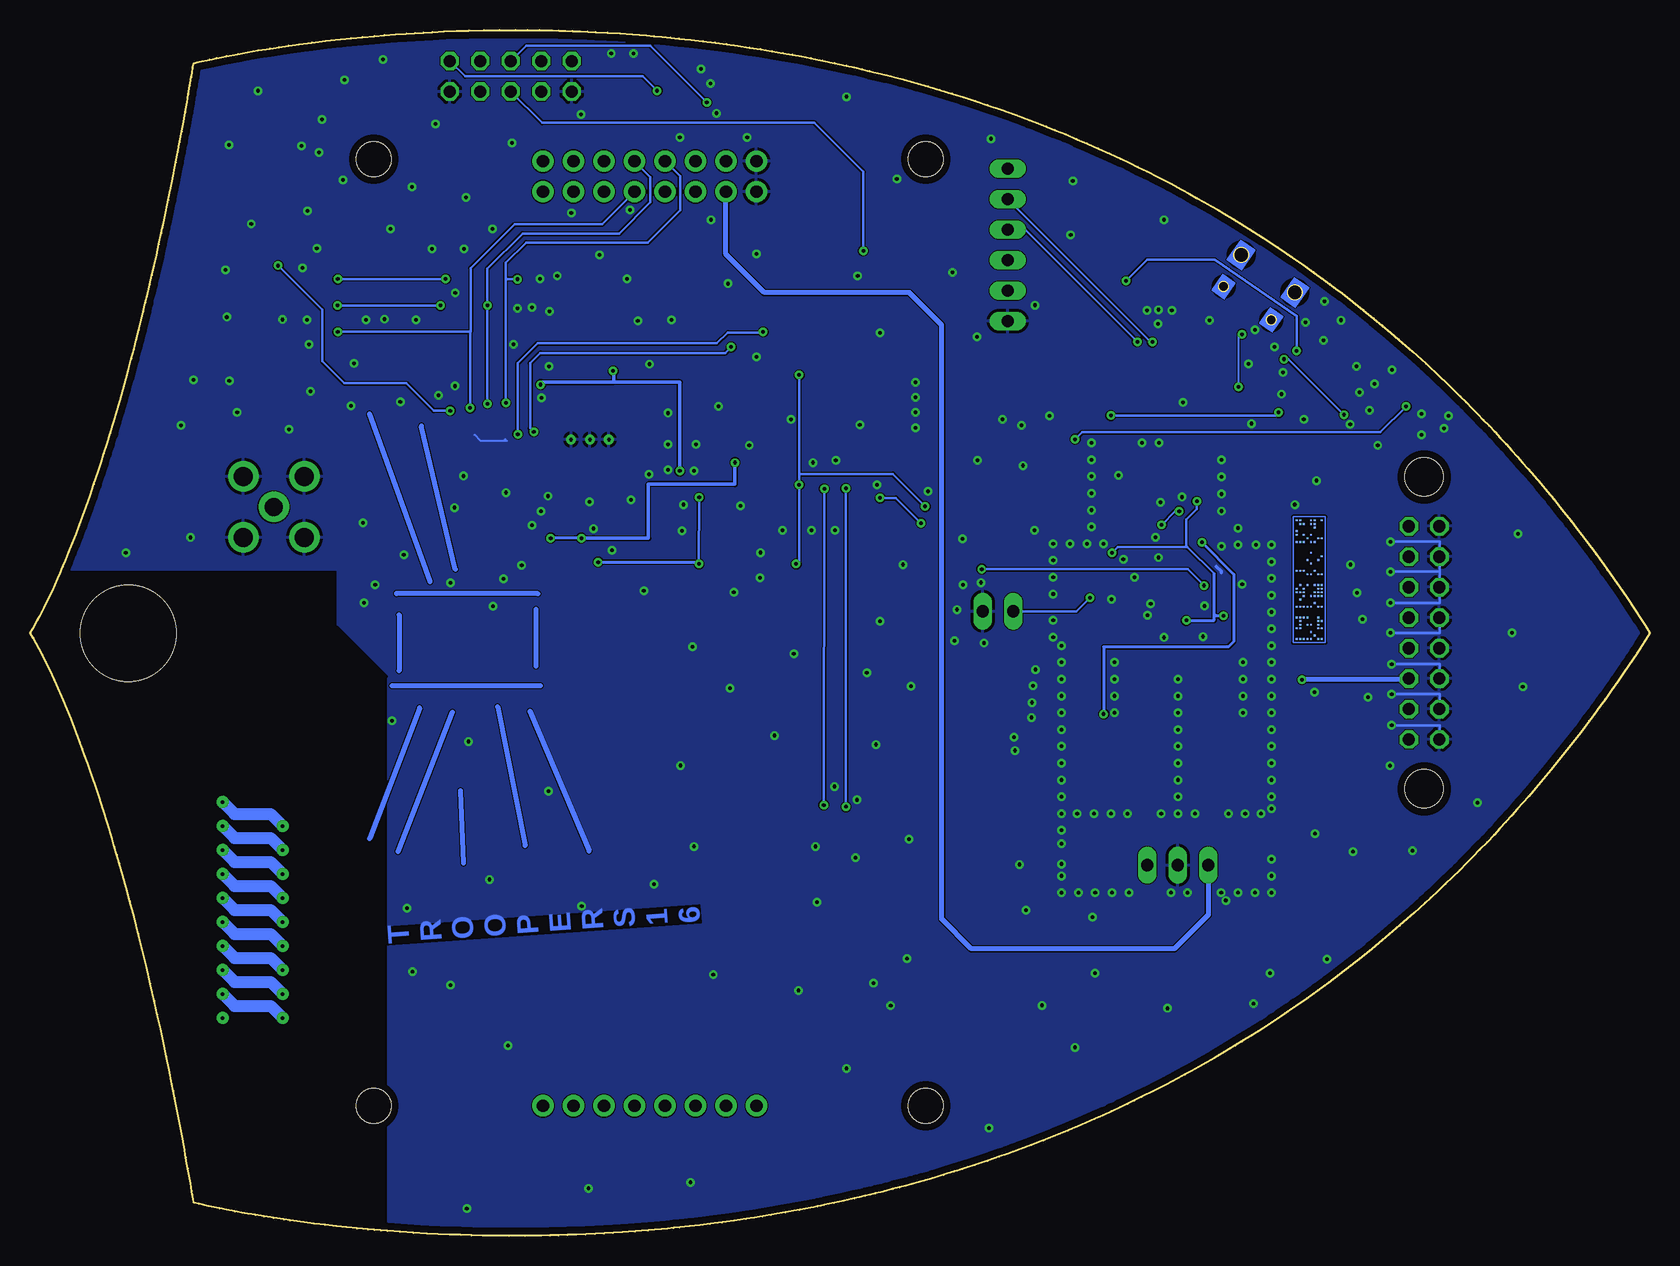
[diagram p6: board, bottom side, seen from below]

Size 135 x 100.53 mm. Coordinates in mm from the lower left corner, seen from the top.
Outline: 446 segments
Copper layers (1*16): Top 0.035mm / dielectric 1.5mm / Bottom 0.035mm
Design rules "default *": minimum track width 0.1mm, minimum drill 0.3mm, track to track 0.1mm, track to pad 0.1mm, pad to pad 0.1mm, via to via 0.1mm, smd to smd 0.1mm, copper to edge 0.6mm, drill to drill 0.2mm, minimum pad ring 10mil, minimum via ring 8mil, stop-mask expansion 4mil, vias tented up to drill 0.4mm, thermal gap 10mil
Holes 3.2 mm at 18.82,63.27 18.82,37.27
Holes 8 mm at 126.81,50.24

### Footprints (pad centres in the part's own frame; a part is rotated, then mirrored left to right if it is on the bottom)
SO-08 = smd 0.6 x 2.2: 1 -1.905,-2.6; 2 -0.635,-2.6; 3 0.635,-2.6; 4 1.905,-2.6; 5 1.905,2.6; 6 0.635,2.6; 7 -0.635,2.6; 8 -1.905,2.6
C0402 = smd 0.75 x 0.7: 1 0,0.5; 2 0,-0.5
KSEM31G = smd 3.1 x 1: A1 -4.45,2; A2 4.45,2; B1 -4.45,-2; B2 4.45,-2
C0603 = smd 1 x 0.95: 1 0,0.8; 2 0,-0.8
C0805 = smd 1.5 x 1.25: 1 0,0.95; 2 0,-0.95
C1206 = smd 1.8 x 1.45: 1 0,1.4; 2 0,-1.4
QFN20-PAD = smd 0.8 x 0.3: 1 -1.9,1; 2 -1.9,0.5; 3 -1.9,0; 4 -1.9,-0.5; 5 -1.9,-1; 11 1.9,-1; 12 1.9,-0.5; 13 1.9,0; 14 1.9,0.5; 15 1.9,1 | smd 0.3 x 0.8: 6 -1,-1.9; 7 -0.5,-1.9; 8 0,-1.9; 9 0.5,-1.9; 10 1,-1.9; 16 1,1.9; 17 0.5,1.9; 18 0,1.9; 19 -0.5,1.9; 20 -1,1.9 | smd 1.5 x 1.5: TP 0,0
USB-MICRO-10103594 = smd 1.8 x 0.4: D+ -2.885,0; D- -2.885,-0.65; GND -2.885,1.3; ID -2.885,0.65; VBUS -2.885,-1.3 | smd 2.5 x 1.425: SHLD1 0.25,-0.963; SHLD2 0.25,0.963 | hole 0.8: -3,2.425; -3,-2.425 | hole 1.2: 0.01,2.725; 0.01,-2.725
L1812 = smd 1.9 x 3.4: 1 -1.95,0; 2 1.95,0
C0603' = smd 0.9 x 0.8: A 0,-0.75; C 0,0.75
1X03 = drill 1.016 long: 1 -2.54,0; 2 0,0; 3 2.54,0
1X02 = drill 1.016 long: 1 -1.27,0; 2 1.27,0
2X08 = drill 1.016 octagon: 1 -8.89,-1.27; 2 -8.89,1.27; 3 -6.35,-1.27; 4 -6.35,1.27; 5 -3.81,-1.27; 6 -3.81,1.27; 7 -1.27,-1.27; 8 -1.27,1.27; 9 1.27,-1.27; 10 1.27,1.27; 11 3.81,-1.27; 12 3.81,1.27; 13 6.35,-1.27; 14 6.35,1.27; 15 8.89,-1.27; 16 8.89,1.27
2X05 = drill 1.016 octagon: 1 -5.08,-1.27; 2 -5.08,1.27; 3 -2.54,-1.27; 4 -2.54,1.27; 5 0,-1.27; 6 0,1.27; 7 2.54,-1.27; 8 2.54,1.27; 9 5.08,-1.27; 10 5.08,1.27
SD_5031821853 = smd 0.65 x 1.6: CS 2.75,0.8; DAT1 -3.85,0.8; DAT2 3.85,0.8; GND -1.65,0.8; MISO -2.75,0.8; MOSI 1.65,0.8; SCK -0.55,0.8; VCC 0.55,0.8 | smd 1 x 1.2: SW1 -6,12.45; SW2 -6,3.3
SMA_CON_THT = drill 1.6 pad 2.54: SHIELD1 -2.54,2.54; SHIELD2 -2.54,-2.54; SHIELD3 2.54,-2.54; SHIELD4 2.54,2.54 | drill 1.5 pad 2.54: SIGNAL 0,0
1X06 = drill 1.016 long: 1 -6.35,0; 2 -3.81,0; 3 -1.27,0; 4 1.27,0; 5 3.81,0; 6 6.35,0
SOT23-BEC = smd 1 x 1.4: B -0.95,-1.1; C 0,1.1; E 0.95,-1.1
NX5032G* = smd 2 x 2.4: 1 -2.1,0; 2 1.9,0
S-PVQFN-N48 = smd 0.85 x 0.28: 1 -3.475,2.75; 2 -3.475,2.25; 3 -3.475,1.75; 4 -3.475,1.25; 5 -3.475,0.75; 6 -3.475,0.25; 7 -3.475,-0.25; 8 -3.475,-0.75; 9 -3.475,-1.25; 10 -3.475,-1.75; 11 -3.475,-2.25; 12 -3.475,-2.75; 25 3.475,-2.75; 26 3.475,-2.25; 27 3.475,-1.75; 28 3.475,-1.25; 29 3.475,-0.75; 30 3.475,-0.25; 31 3.475,0.25; 32 3.475,0.75; 33 3.475,1.25; 34 3.475,1.75; 35 3.475,2.25; 36 3.475,2.75 | smd 0.28 x 0.85: 13 -2.75,-3.475; 14 -2.25,-3.475; 15 -1.75,-3.475; 16 -1.25,-3.475; 17 -0.75,-3.475; 18 -0.25,-3.475; 19 0.25,-3.475; 20 0.75,-3.475; 21 1.25,-3.475; 22 1.75,-3.475; 23 2.25,-3.475; 24 2.75,-3.475; 37 2.75,3.475; 38 2.25,3.475; 39 1.75,3.475; 40 1.25,3.475; 41 0.75,3.475; 42 0.25,3.475; 43 -0.25,3.475; 44 -0.75,3.475; 45 -1.25,3.475; 46 -1.75,3.475; 47 -2.25,3.475; 48 -2.75,3.475 | smd 5.15 x 2: PAD1 0,1.573; PAD2 0,-1.573 | drill 0.3: PAD3 -1.573,0; PAD4 0,0; PAD5 1.573,0
CMR200T = smd 2.5 x 1: X1 0,1.25; X2 0,-1.25 | smd 2.5 x 2.5: Z -5.75,0
BB_TEST = smd 0.15 x 0.15: P$9 0.3,-0.3; P$10 2.1,-0.3; P$11 0.3,-0.6; P$12 1.8,-0.6; P$13 1.5,-0.6; P$14 1.2,-0.6; P$15 0.3,-0.9; P$16 1.2,-0.9; P$17 1.8,-0.9; P$18 0.3,-1.2; P$19 2.1,-1.2
MESSAGE = smd 0.15 x 0.15: P$26 0.3,-0.3; P$34 0.3,-0.6; P$35 0.3,-0.9; P$36 0.3,-1.2; P$37 0.3,-1.5; P$38 0.3,-2.1; P$39 0.3,-2.4; P$40 0.6,-1.8; P$41 0.9,-1.5; P$42 1.2,-0.3; P$43 2.1,-0.3; P$44 2.1,-0.6; P$45 1.8,-0.6; P$46 1.5,-0.6; P$47 1.2,-0.6; P$48 2.1,-0.9; P$49 2.1,-1.2; P$50 1.5,-1.2; P$51 1.5,-1.5; P$52 2.1,-2.1; P$53 1.8,-2.1; P$54 1.5,-2.1; P$55 1.2,-2.1; P$56 1.2,-2.4; P$57 1.8,-2.4; P$58 3,-0.3; P$59 3,-0.6; P$60 3,-0.9; P$61 3,-1.2; P$62 3,-1.5; P$63 3,-2.1; P$64 3,-2.4; P$65 3.3,-1.8; P$66 4.5,-0.3; P$67 4.2,-0.3; P$68 4.8,-0.6; P$69 4.2,-0.6; P$70 3.6,-0.6; P$71 4.5,-0.9; P$72 4.2,-0.9; P$73 3.9,-0.9; P$74 4.8,-1.2; P$75 3.9,-1.5; P$76 3.9,-1.8; P$77 4.2,-1.8; P$78 4.8,-1.8; P$79 4.8,-2.1; P$80 4.5,-2.1; P$81 4.2,-2.1; P$82 3.9,-2.1; P$83 3.9,-2.4; P$84 4.2,-2.4; P$85 4.5,-2.4; P$86 4.8,-2.4; P$87 6,-0.3; P$88 6,-0.6; P$89 6,-0.9; P$90 5.7,-1.2; P$91 5.7,-1.5; P$92 6,-1.8; P$93 5.7,-2.1; P$94 5.7,-2.4; P$95 6.9,-1.2; P$96 6.6,-1.5; P$97 7.5,-1.5; P$98 6.9,-2.1; P$99 7.2,-2.4; P$100 8.4,-0.3; P$101 8.4,-0.6; P$102 8.4,-0.9; P$103 8.4,-1.5; P$104 8.4,-1.8; P$105 10.2,-0.3; P$106 9.3,-0.3; P$107 9,-0.3; P$108 10.2,-0.6; P$109 9.9,-0.6; P$110 9.9,-0.9; P$111 9,-0.9; P$112 8.7,-1.2; P$113 8.7,-2.1; P$114 8.7,-2.4; P$115 10.2,-1.5; P$116 9.9,-1.5; P$117 9,-1.5; P$118 10.2,-1.8; P$119 9.9,-1.8; P$120 9.6,-1.8; P$121 10.2,-2.4
TR_BRAILLE = smd 0.15 x 0.15: P$17 0.3,-0.3; P$18 0.3,-0.6; P$19 0,-0.6; P$20 0,-0.9; P$21 0.9,-0.3; P$22 0.9,-0.6; P$23 0.9,-0.9; P$24 1.2,-0.6; P$25 1.65,-0.3; P$26 1.95,-0.6; P$27 1.65,-0.9; P$28 2.7,-0.3; P$29 2.4,-0.3; P$30 2.4,-0.6; P$31 2.4,-0.9; P$32 3.45,-0.3; P$33 3.15,-0.3; P$34 3.15,-0.6; P$35 3.15,-0.9; P$36 4.05,-0.3; P$37 4.35,-0.6; P$38 4.95,-0.3; P$39 4.95,-0.6; P$40 4.95,-0.9; P$41 5.25,-0.6; P$42 6.15,-0.3; P$43 5.85,-0.6; P$44 5.85,-0.9
QFN-20-3X3 = smd 0.7 x 0.2: 1 -1.4,0.8; 2 -1.4,0.4; 3 -1.4,0; 4 -1.4,-0.4; 5 -1.4,-0.8; 11 1.4,-0.8; 12 1.4,-0.4; 13 1.4,0; 14 1.4,0.4; 15 1.4,0.8 | smd 0.2 x 0.7: 6 -0.8,-1.4; 7 -0.4,-1.4; 8 0,-1.4; 9 0.4,-1.4; 10 0.8,-1.4; 16 0.8,1.4; 17 0.4,1.4; 18 0,1.4; 19 -0.4,1.4; 20 -0.8,1.4 | smd 1.65 x 1.65: GND 0,0
MI0283QT = drill 1.02 pad 1.778: !ADS-CS -3.81,-36.785; !CS 1.27,-36.785; !RST 3.81,-39.325; AUX -6.35,-39.325; BUSY -3.81,-39.325; GND0 8.89,-39.325; GND1 8.89,-36.785; IRQ -6.35,-36.785; LED 3.81,-36.785; MISO -1.27,-36.785; MOSI 1.27,-39.325; NC0 -8.89,39.415; NC1 -6.35,39.415; NC2 -3.81,39.415; NC3 -1.27,39.415; NC4 1.27,39.415; NC5 3.81,39.415; NC6 6.35,39.415; NC7 8.89,39.415; SCK -1.27,-39.325; VBAT -8.89,-36.785; VCC0 6.35,-39.325; VCC1 6.35,-36.785; VREF -8.89,-39.325 | hole 2.89: -23,39.415; 23,39.415; 23,-39.5; -23,-39.5
JST-2 = smd 1 x 4.5: 1 -1,-2.5; 2 1,-2.5 | smd 1.5 x 3.4: NC1 -3.35,2.55; NC2 3.35,2.55
PASSER_07MM = smd 0.7 x 0.7: X 0,0
PAD-0.5 = smd 0.5 x 0.5: 1 0,0
PAD-1.27X1.27 = smd 1.27 x 1.27: 1 0,0

### Placement (x,y rotation side)
25AA1024T  98.42,87.16 270 top
B_LOADER_PDWN  73.55,61.22 270 top
BOOTLOADER_BTN  53.1,65.77 90 top
BTN_RESET  47.9,82.51 270 top
C1  84.64,74.07 180 top
C2  93.86,72.28 315 top
C3  86.23,74.24 0 top
C4  86.05,55.6 270 top
C5  78.4,62.97 90 top
C6  78.43,60.4 270 top
C7  74.08,64.46 90 top
C8  91.64,56.5 180 top
C9  89.05,56.5 180 top
C10  102.68,61.85 90 top
C11  102.54,68.14 90 top
C12  92.19,54.33 270 top
C13  88.49,54.3 90 top
C14  82.15,60.97 90 top
C15  94.39,60.39 135 top
C16  96.73,62.18 225 top
C17  96.92,63.96 225 top
C18  99.39,59.15 135 top
C19  101.29,55.72 315 top
C20  105.13,53.17 135 top
C21  106.71,50.88 225 top
C22  107.05,45.45 0 top
C23  42.47,60.11 0 top
C24  46.65,55.69 270 top
C25  44.31,41.97 270 top
C26  34.35,41.98 270 top
C27  43.94,36.72 90 top
C28  34.74,36.67 90 top
C29  39.35,48.41 0 top
C30  27.2,75.68 270 top
C31  27.2,76.57 270 top
C32  24.17,68.85 180 top
C33  36.13,73.72 270 top
C34  33.05,73.92 270 top
C35  55.66,57.52 0 top
C36  53.1,57.17 180 top
IC2  27.18,70.75 90 top
J1  31.83,80.21 125 top
L1  78.36,64.87 270 top
L2  42.33,45.91 270 top
L3  36.33,45.91 270 top
L4  93.94,62.33 135 top
L5  97.26,59.92 315 top
L6  94.91,64.01 45 top
L7  100.32,57.5 225 top
L8  103.1,54.52 225 top
L9  106.54,42.97 90 top
LED1  [C0603']  47.89,52.02 180 top
LOGO1  45.42,16.16 270 top
NC-IC3  66.25,69.26 270 top
NC-JP1  39.35,30.9 180 top
NC-JP2  54.32,52.07 0 top
NC-JP4  18.82,50.27 270 top
NC-JTAG  94.94,96.67 180 top
NC-R15  111.88,87.29 90 top
NC-R16  70.94,66.86 180 top
NC-R17  70.94,69.3 0 top
NC-R18  115.88,69.8 270 top
NC-R21  115.89,68.66 270 top
NC-SD1  117.62,78.12 90 top
NC-U$10  114.68,60.77 0 top
NC-UART  53.52,82.61 90 top
NC_C35  97.4,75.55 0 top
NC_C36  99.5,72.73 180 top
NC_LED2  [C0603']  21.29,67.47 180 top
NC_R2  109.01,50.53 270 top
NC_R3  107.05,48.5 0 top
NC_R5  21.44,70.39 0 top
NC_R13  38.51,62.72 270 top
NC_R14  39.22,58.78 180 top
NC_R15  36.79,34.02 0 top
NC_R16  41.88,34 0 top
NC_R18  61.5,84.66 270 top
NC_R19  61.5,85.72 270 top
Q2  79.55,80.97 180 top
Q2_24MHZ  90.35,51.67 0 top
R1  82.15,61.97 270 top
R2  43.31,52.92 90 top
R3  57.29,55.59 270 top
R4  44.32,40.98 90 top
R5  34.35,40.98 90 top
R6  45.01,39.23 180 top
R7  33.64,39.22 180 top
R8  43.98,50.91 90 top
R9  32.21,71.45 270 top
R10  32.21,70.55 270 top
R11  35.45,53.16 180 top
R12  41.38,62.72 270 top
R13  98.16,90.88 0 top
R14  99.45,90.88 0 top
R15  53.1,60.87 180 top
R19  25.1,74.67 270 top
R20  25.12,73.66 90 top
U$1  88.34,66.39 180 top
U$2  101.56,65.03 180 top
U$3  101.13,7.44 270 top
U$4  29.74,49.45 90 bottom
U$5  53.86,17.16 270 top
U$6  86.07,45.76 270 top
U$7  91.89,15.54 180 top
U$11  39.53,54.21 270 top
U$14  83.35,50.27 180 top
U$15  54.05,42.27 180 top
X1  9.05,50.27 0 top
X2  88.75,21.67 0 top
X3  93.6,75.87 0 top
X4  97.65,66.17 0 top
X5  82.86,65.68 0 top
X6  83.45,66.14 0 top
X7  82.86,66.67 0 top
X10  41.54,70.58 0 top
X12  34.45,30.48 0 top
X13  44.22,30.47 0 top
X14  74.89,62.67 0 top
X15  48.2,68.42 0 top
X16  44.9,69.87 90 top
X17  23.12,72.33 0 top
X18  79.67,77.94 0 top
X19  82.27,77.94 0 top
X20  36.89,59.29 0 top
X21  90.59,72.27 0 top

### Tracks (layer width: path | path; a pad name or v marks a point on that pad's centre or on a via)
3V3  (via drill 0.3)
  Top 0.2: NC-IC3.3 65.62,68.63 68.16,71.17 NC-IC3.8 70.9,71.17 70.9,71.72 70.93,71.74 | 106.79,78.67 NC-SD1.VCC 118.21,78.67 119.76,77.12 119.76,71.46 118.1,69.8 NC-R18.1 NC-R21.1 | 106.79,78.67 103.5,78.67 99.23,74.39 | 99.23,74.39 99.16,74.32 99.51,73.97 NC_C36.2 | NC_C35.2 98.41,75.05 | 98.41,75.05 98.57,75.05 99.23,74.39 | v70.9,62.62 70.93,62.64 NC-R16.1 | v70.9,71.77 70.93,71.74 | 70.93,71.74 NC-R17.1 | U$1.44 89.09,59.06 87.65,57.62 v87.65,56.17 87.08,55.6 C4.1 | 106.79,78.67 106.79,86.87 | 106.79,86.87 106.02,87.64 104.43,87.64 103.03,89.04 101.05,89.04 25AA1024T.8 101.03,90.78 99.45,92.36 | NC-JTAG.8 92.4,93.93 93.53,92.8 98.08,92.8 | NC-R15.1 110.96,86.87 106.79,86.87 | C2.2 93.51,71.74 95.1,71.74 98.41,75.05 | v86.41,72.11 86.59,71.93 U$1.22 | v60.4,60.82 59.05,62.17 59.05,71.02 57.35,72.72 51.1,72.72 BOOTLOADER_BTN.A2 BOOTLOADER_BTN.A1 | v79.23,61.56 C6.1 | C5.2 78.9,61.89 v79.23,61.56 | 80.85,61.97 79.64,61.97 v79.23,61.56 | 98.08,92.8 99.01,92.8 99.45,92.36 | R14.1 99.45,92.36 | R13.1 98.16,92.72 98.08,92.8
  Top 0.28: U$1.34 80.85,64.64 v80.85,63.77 80.85,62.91 | U$1.13 91.34,69.86 v92.45,70.97
  Top 0.3: 80.85,62.91 80.85,61.97 R1.2 | v92.45,70.97 92.55,70.97 C2.2 | C3.2 86.23,72.29 v86.41,72.11 | X13.1 41.89,30.47 NC-JP1.1
  Top 0.4: L2.2 43.68,43.96 43.68,42.41 C25.2 43.68,42.13 43.68,41.05 R4.1 42.99,40.07 C27.1 41.88,35.61 NC_R16.1 NC_R16.2 41.88,33.2 41.88,31.41
  Top 0.406: v79.25,56.02 v71.15,56.02 62.85,47.72 62.85,40.17 54.6,31.92 41.88,31.92 41.88,31.41 NC-JP1.1 41.87,27.41 40.35,25.89 32.25,25.89 28.9,29.44 v29,46.37
  Bottom 0.2: v71.15,56.02 70.9,56.27 v70.9,62.62 70.9,63.52 | 70.9,63.52 v70.9,71.77 | 70.9,63.52 63.1,63.52 v60.4,60.82 | v79.25,56.02 v79.23,61.56
  Bottom 0.25: v87.65,56.17 79.25,56.17
  Bottom 0.28: v92.45,70.97 92.25,71.17 86.34,71.18 86.14,71.18 80.85,71.17 v80.85,63.77
  Bottom 0.3: v86.41,72.11 86.34,72.04 86.34,71.18
  Bottom 0.4: 79.25,55.97 v79.25,56.02 79.25,56.17 | NC-JP4.12
  Bottom 0.406: NC-JP4.12 20.16,46.39 28.3,46.39 v29,46.37
!BCD
  Top 0.2: R20.2 26.18,73.09 IC2.15
!PWREN
  Top 0.2: R19.1 26.68,73.59 IC2.14
!RESET  (via drill 0.3)
  Top 0.2: C14.2 82.1,60.17 81.53,59.6 63.62,59.6 60.1,63.12 60.1,73.88 | BTN_RESET.A2 49.9,75.22 51.24,73.88 60.1,73.88 | v65.55,82.12 60.1,76.67 60.1,73.88
  Top 0.3: U$1.35 82.65,64.14 R1.1 C14.2
  Top 0.4: BTN_RESET.A1 BTN_RESET.A2
  Bottom 0.2: v65.55,82.12 65.55,88.72 69.63,92.79 92.33,92.79 NC-JTAG.6
!SLEEP  (via drill 0.3)
  Top 0.2: U$11.19 41.69,54.61 43.23,56.14 43.23,57.17 44.95,58.89 44.95,64.47 44.93,64.49 v44.93,68.39 44.9,68.39 X16.1 | v30.95,68.64 30.95,69.02 29.72,70.25 IC2.7
  Bottom 0.2: v30.95,68.64 31.2,68.39 v44.93,68.39
BG_LIGHT
  Top 0.2: Q2.B 83.33,79.24 | 83.33,79.24 87.09,75.48 U$1.21 | X19.1 82.27,78.18 83.33,79.24
BOOTLOADER_BACKDOOR  (via drill 0.3)
  Top 0.2: U$1.30 84.86,66.67 X7.1 73,66.67 71.95,65.62 71.95,61.57 | BOOTLOADER_BTN.B1 BOOTLOADER_BTN.B2 | 71.95,61.57 71.1,60.72 66,60.72 65.2,61.52 v64.15,61.52 | 55.4,61.62 BOOTLOADER_BTN.B1 | v60.75,59.42 55.1,59.42 BOOTLOADER_BTN.B1 | B_LOADER_PDWN.2 72.7,61.57 71.95,61.57
  Bottom 0.2: v60.75,59.42 62.85,61.52 v64.15,61.52
D_!CS
  Top 0.2: U$1.19 88.09,79.83 82.08,85.84 U$14.!CS
D_!RST
  Top 0.2: U$1.20 87.59,78.73 80.85,85.47 80.85,88.28 U$14.!RST
D_ADS_!CS
  Top 0.2: U$1.18 88.59,85.63 U$14.!ADS-CS
D_BUSY
  Top 0.2: U$14.BUSY 88.49,88.27 90.65,88.27 90.95,87.97 90.95,83.67 89.59,82.31 U$1.16
D_IRQ
  Top 0.2: U$1.17 89.09,86.44 U$14.IRQ
DM
  Top 0.15: R9.2 31.55,71.14 29.19,71.14 IC2.9
DP
  Top 0.15: R10.2 31.55,70.84 29.18,70.84 IC2.8
EEPROM_!CS
  Top 0.2: U$1.15 90.11,69.88 90.11,82.05 93.81,85.75 93.81,88.56 94.32,89.06 25AA1024T.1
FB1  (via drill 0.3)
  Top 0.25: v37.33,57.81 38.13,57.01 U$11.6 | v45.53,43.51 45.53,42.86 44.94,42.27 C25.1
  Top 0.4: R6.2 45.01,40.72 R4.2 44.98,41.07 44.98,42.11 C25.1
  Bottom 0.25: v45.53,43.51 45.53,49.11 35.13,49.11 34.67,49.57 34.67,55.15 v37.33,57.81
FB2
  Top 0.2: U$11.7 37.63,54.61 36.93,55.31
  Top 0.4: R7.2 33.68,39.71 33.68,40.81 R5.1 | 36.93,55.31 33.03,55.31 33.03,54.61 33.03,42.8 C26.2 R5.1 | 33.68,41.15 R5.1
FTDI_RXD  (via drill 0.3)
  Top 0.2: NC-UART.5 54.22,85.72 NC_R19.2 NC_R19.1 64.96,85.72 v76.58,74.1 | IC2.1 26.18,67.04 26.67,66.55 33.5,66.55 v41.47,74.52 | U$1.8 92.91,67.14 v93.02,67.03
  Bottom 0.2: v41.47,74.52 41.62,74.52 NC-UART.5 | v76.58,74.1 77.07,73.61 92.46,73.61 93.32,72.76 93.32,67.33 v93.02,67.03
FTDI_TXD  (via drill 0.3)
  Top 0.2: NC-UART.4 54.3,84.66 NC_R18.2 NC_R18.1 64.61,84.66 v73.9,75.37 | IC2.17 24.13,71.25 22.69,69.8 22.69,67.8 24.59,65.9 34.08,65.9 v42.72,74.53 | U$1.7 92.29,66.64 92.5,66.42 93.93,66.42 v94.35,66.84
  Bottom 0.2: v42.72,74.53 52.07,83.88 NC-UART.4 | v73.9,75.37 73.95,75.32 76.85,75.32 77.75,74.42 92.7,74.42 94.35,72.77 v94.35,66.84
GND  (via drill 0.3)
  Top 0.15: R12.1 42.48,62.12 C23.1
  Top 0.2: C27.2 44.88,36.51 | 33.63,36.66 33.63,36.51 | 39.03,54.21 U$11.GND 40,53.74 40,53.65 40.33,53.32 U$11.15 | 39.03,54.21 38.83,54.21 38.83,54.91 40.19,53.55 40.19,53.5 40.33,53.36 40.33,52.98 41.19,52.12 v41.61,52.71 | 39.03,54.21 38.83,54.01 38.83,53.61 38.63,53.41 U$11.10 38.13,53.31 | NC-JP4.11 17.55,45.17 v21.52,45.17 17.52,45.17 17.52,43.97 | 17.52,57.87 17.52,56.67 | 17.52,55.37 17.52,56.57 | v21.62,55.37 17.52,55.37 | 17.52,55.37 17.52,54.17 | 17.52,52.77 17.52,54.07 | v21.62,52.77 17.52,52.77 | 17.52,52.77 17.52,51.57 | 17.52,50.27 17.52,51.47 | v21.62,50.27 17.52,50.27 | 17.52,47.67 17.52,50.27 | v21.52,47.67 17.52,47.67 | 17.52,47.67 17.52,46.47 | v21.62,57.87 17.52,57.87 | 17.52,57.87 17.52,59.17 | NC-IC3.4 v61.2,67.35 | NC-IC3.2 v61.22,69.89 v61.21,69.88 v61.21,68.64 | NC-IC3.1 63.64,71.15 v61.22,71.15 | C31.2 C30.2 | v65.85,67.62 68.13,69.9 NC-IC3.7 | C1.2 84.69,74.74 C3.1 | IC2.13 v27.19,74.65 | v28.85,68.07 27.18,68.07 IC2.3 27.15,68.88 27.15,70.72 | IC2.13 27.2,72.65 | C5.1 77.9,61.2 | v21.51,72.2 22.1,72.79 22.1,73.23 22.18,73.3 23.71,73.3 24.44,72.58 v24.44,72.48 | 24.22,70.35 23.99,70.35 23.37,69.73 v23.37,68.81 23.37,67.9 23.71,67.56 24.93,67.56 | v22.94,71.03 22.25,70.34 22.25,65.9 v22.69,65.9 | IC2.TP IC2.13
  Top 0.28: U$1.PAD5 U$1.PAD4 | U$1.PAD4 U$1.PAD3 | U$1.PAD4 U$1.PAD1 | U$1.PAD4 U$1.PAD2
  Top 0.3: v80.55,60.97 C14.1
  Top 0.4: NC-U$10.SHIELD2 NC-U$10.SHIELD1 NC-U$10.SHIELD4 NC-U$10.SHIELD3 | 45.03,36.61 C27.2 | C28.1 33.63,36.66 | BTN_RESET.B1 BTN_RESET.B2 | 44.88,35.26 v44.93,35.21 44.93,36.67 C27.2 | 33.63,35.31 33.7,35.24 | 33.7,35.24 v33.73,35.21 | U$14.GND1 U$14.GND0 | 45.01,36.74 C27.2 | J1.GND 33.03,76.23 33.03,75.65 v32.9,75.52 | R7.1 33.64,36.82 C28.1 | R6.1 45.01,36.84 C27.2 | 33.7,35.24 33.7,36.58 C28.1
  Top 0.6: v104.83,42.96 L9.1 | U$1.PAD5 86.76,64.8 89.91,64.8 89.91,67.96 86.79,67.96 86.79,66.39
  Bottom 0.15: 97.95,66.79 97.46,66.3 95.43,66.3 95.26,66.3
  Bottom 0.2: v21.62,57.87 17.52,57.87 17.52,55.37 | v21.62,55.37 17.52,55.37 | 17.52,55.37 17.52,54.07 | v21.62,52.77 17.52,52.77 17.52,53.97 | v21.62,50.27 17.52,50.27 17.52,51.47 | v21.52,47.67 17.52,47.67 17.52,46.47 | v21.52,45.17 17.52,45.17 17.52,43.97 | v21.52,42.57 17.52,42.57 17.52,41.37 | 95.39,66.37 95.39,66.33 95.43,66.3
  Bottom 0.3: 35.73,55.31 35.73,55.41 36.13,55.81
  other vias: 44.88,53.09 46.53,59.11 49.03,49.21 49.03,47.81 49.03,46.41 49.03,45.01 49.03,43.61 49.03,42.21 49.03,40.81 49.03,39.41 49.03,38.01 49.03,36.61 49.03,35.21 49.03,30.01 49.03,28.61 44.83,28.61 39.33,46.41 39.33,45.01 39.33,43.61 39.33,42.21 39.33,40.81 39.33,39.41 39.33,38.01 39.33,36.61 80.66,58.77 75.8,60.86 88.05,58.97 35.7,57.48 41.2,58.24 31.53,52.01 31.53,53.41 31.53,54.81 31.53,56.21 31.53,57.61 40.93,66.11 42.33,66.11 46.53,66.11 46.53,64.71 46.53,63.31 46.53,61.91 46.53,60.51 45.53,57.71 46.93,57.71 48.33,57.71 49.73,57.71 49.73,56.31 49.73,54.91 49.73,53.51 49.73,51.31 49.73,49.91 47.63,28.61 43.43,28.61 46.23,28.61 39.93,28.61 38.53,28.61 35.73,28.61 34.33,28.61 32.93,28.61 31.53,28.61 31.53,30.01 31.53,31.41 31.53,38.01 31.53,39.41 31.53,40.81 31.53,42.21 31.53,43.61 31.53,45.01 31.53,46.41 31.53,47.81 31.53,49.21 31.53,50.61 32.83,57.61 34.33,57.61 34.33,59.01 91.74,72.5 92.49,79.77 91.7,77.09 93.18,77.4 94.36,77.31 94.7,74.32 64.15,75.27 66.02,80.04 85.26,79.78 91.06,80.02 74.45,81.87 74.45,73.27 78.06,21.78 79.65,32.47 69.55,32.47 40.51,49.89 42.96,54.89 33.98,54.33 33.93,47.81 33.93,46.41 33.93,45.01 33.93,43.61 49.03,33.81 49.03,32.71 49.03,31.01 31.53,36.61 31.53,35.61 39.33,35.21 32.43,35.21 35.13,35.21 37.93,35.21 40.73,35.21 43.53,35.21 46.33,35.21 47.73,35.21 70.95,20.47 35.35,27.97 107.15,52.77 106.23,54.28 103.85,56.77 99.97,54.46 99.63,60.72 98.87,63.35 95.55,54.77 55.75,54.47 11.51,50.3 24.98,67.64 98.65,86.56 50.05,68.37 44.63,47.81 44.63,46.41 44.63,45.01 44.63,43.61 100.95,70.07 74.15,54.87 74.13,56.97 57.3,58.12 56.05,64.67 64.51,40.97 66.08,36.35 69.41,27.82 101.22,92.71 110.93,90.33 17.15,67.32 16.8,68.37 19.03,66.79 19.05,68.52 39.85,77.17 40.95,77.22 41.9,77.17 40.99,76.05 36.7,76.32 25.75,76.34 27.12,77.89 69.75,64.47 52.37,67.58 52.25,64.22 55.49,49.43 52.9,40.47 52.55,30.97 61.58,45.81 61.75,33.07 53.95,68.07 60.15,62.07 62.25,55.97 67.9,58.83 67.95,37.47 72.95,41.72 76.65,45.67 79.8,49.12 76.35,53.67 71.35,48.52 98.45,41.22 80.8,39.22 91.8,37.07 83,29.32 99.95,20.92 95.15,15.87 96.7,29.72 108.8,96.37 116,95.47 110.65,93.07 118.41,90.94 112.37,90.86 111.1,82.32 111.76,74.33 104.95,83.94 113.41,67.23 66.95,94.97 62.77,88.12 54.9,91.47 40.5,84.72 11,58.52 10.6,45.77 23.5,44.92 23.95,51.42 24.4,53.62 24.95,55.97 24.75,32.02 46.45,26.57 52,27.17 27.8,62.97 29.6,60.97 98.6,2.27 47.9,15.72 46.25,21.92 61.9,23.12 66.2,31.52 78.25,84.72 81.55,76.37 105.59,98.08 67.85,64.67 64.41,62.62 84.9,61.37 92.36,69.88 87.55,81.77 33.05,19.37 26.9,23.07 44.3,63.42 37.25,49.97 38.9,69.48 33.2,67.72 24.22,70.33 84.69,98.57 86.56,98.56 83.85,53.77 96.43,52.5 79.95,4.47 88.45,3.97 66.95,13.97 84.35,76.27 35.72,60.43 35.72,61.85 35.71,63.27 35.7,64.69 89.89,85.3 58.13,80.32 111.9,76.38 102.84,76.38 99.56,78.61 89.09,93.49 79.07,97.3 78.29,96.09 101.49,82.3 98.82,82.27 96.47,83.94 94.82,91.12 80.85,91.58 75.23,91.58 76.82,79.39 116.56,84.37 108.93,88.03 111.86,85.44 118.69,80.53 118.6,76.6 118.39,71.3 111.63,70.42 108,72.73 104.14,69.52 108.26,69.21 107.26,59.46 95.32,61.97 103.16,87.46 51.55,43.22 51.5,44.47 51.4,45.87 51.2,47.22 53,41.57 57.75,52.22 57.95,49.62 57.25,54.27 83.43,63.49 81.83,63.86 39.01,61.6 83.37,72.68 77.62,69.15 75.06,65.92 88.36,61.21 91.84,61.68 92.4,60.4 94.02,55.92 79.51,66 99.58,70.85 93.16,59.24 79.66,63.77 77.8,93.59 19.78,32.13 14.36,36.1 21.65,39.19 89.02,27.48 33.44,72.69 30.58,72 30.7,70.18 56.09,74.95 48.27,83.45 51.24,77.59 50.67,19.22 63.27,19.2 40.21,18.97 55.1,9 127.02,56.95 121.64,58.22 122.42,67.58 48.1,87.95 64.18,51.25 65.27,46.94 37.13,52.51 41.88,51.74 43.89,56.39 40.79,61.17 40.97,56.55 31.67,21.89 27.93,33.55 27.94,45.31 103.58,27.32 103.12,22.05 71.59,68.08 81.82,68.6 81.84,65.98 86.5,57.17 31.3,74.12 28.7,76.17 69.86,58.81 72.29,58.82 105.44,76.43 113.95,76.39 112.28,80.7 106.99,76.38 85.01,85.52 64.69,21.09 117.73,68.67 121.37,71.36 51.3,58.82
  pour Top: -5.55,104.77 136.45,104.77 136.45,55.57 109.35,55.57 109.35,50.97 105.15,46.77 105.15,-1.53 -5.55,-1.53
  pour Bottom: -5.55,104.77 136.45,104.77 136.45,55.57 109.35,55.57 109.35,50.97 105.05,46.67 105.05,46.57 105.15,46.47 105.15,-1.53 -5.55,-1.53
I2C_SCL  (via drill 0.3)
  Top 0.2: v67.01,62.32 67,67.92 67.71,68.63 NC-IC3.6 69.03,68.8 NC-R17.2 71.75,68.82 72.94,67.64 U$1.28 | v67,35.77 67,26.77 61.4,21.17 31.15,21.17 24.05,28.27 24.05,42.02 22.15,43.92 NC-JP4.14
  Bottom 0.2: v67.01,62.32 v67,35.77
I2C_SDA  (via drill 0.3)
  Top 0.2: NC-R16.2 | v68.8,62.28 NC-IC3.5 NC-R16.2 | v68.85,35.92 67.8,34.87 67.8,25.87 62.3,20.37 30.75,20.37 23,28.12 23,40.12 21.74,41.38 NC-JP4.16 | NC-R16.2 71.61,67.36 71.86,67.11 71.88,67.14 U$1.29
  Bottom 0.2: v68.8,62.28 v68.85,35.92
IO1
  Top 0.2: U$1.37 85.59,60.36 63.7,38.47 63.7,28.72 59.23,24.24 32.03,24.24 27.05,29.22 27.05,55.12 23,59.17 NC-JP4.2
IO2
  Top 0.2: U$1.38 86.09,60.23 64.1,38.24 64.1,28.47 59.45,23.82 31.8,23.82 26.65,28.97 26.65,52.82 22.85,56.62 NC-JP4.4
IO3
  Top 0.2: U$1.39 86.59,60.01 64.5,37.92 64.5,28.27 59.65,23.42 31.55,23.42 26.25,28.72 26.25,50.47 22.65,54.07 NC-JP4.6
IO4
  Top 0.2: U$1.40 87.09,59.71 64.9,37.52 64.9,28.07 59.85,23.02 31.25,23.02 25.85,28.42 25.85,48.22 22.55,51.52 20.11,51.52 NC-JP4.8
IO5
  Top 0.2: U$1.41 87.59,62.88 87.6,62.87 87.6,59.52 65.3,37.22 65.3,27.77 60.15,22.62 30.95,22.62 25.45,28.12 25.45,46.32 22.75,49.02 20.11,49.02 NC-JP4.10
JTAG_TCK  (via drill 0.3)
  Top 0.2: U$1.25 84.29,69.14 68.15,85.27 68.15,88.06 75.56,95.47 v82.74,95.47
  Bottom 0.2: NC-JTAG.1 98.75,96.67 83.94,96.67 v82.74,95.47
JTAG_TDI
  Top 0.2: U$1.27 83.54,68.14 67.03,84.64 67.03,88.53 76.43,97.94 NC-JTAG.9
JTAG_TDO
  Top 0.2: U$1.26 83.94,68.64 67.58,84.99 67.58,88.29 75.95,96.67 96.21,96.67 NC-JTAG.3
JTAG_TMS  (via drill 0.3)
  Top 0.2: U$1.24 84.36,69.86 68.8,85.42 68.8,87.89 75.4,94.49 v78.6,94.49
  Bottom 0.2: v78.6,94.49 83.33,99.22 93.66,99.22 NC-JTAG.5
LED_A
  Top 0.2: U$14.LED Q2.C 79.55,78.05 X18.1
N$2
  Top 0.2: U$1.4 98.35,65.14 99.65,63.83 101.51,63.83 U$2.X1 101.56,62.48 C10.1
N$3
  Top 0.28: U$1.33 79.16,65.14 L1.1
N$4
  Top 0.2: U$1.47 90.59,54.31 | 90.59,54.31 90.59,52.83 91.75,51.67 Q2_24MHZ.2 | C12.2 90.61,54.33 90.59,54.31
N$5
  Top 0.2: U$1.46 90.09,54.23 | 90.09,54.23 90.09,53.01 88.75,51.67 Q2_24MHZ.1 | C13.2 90.02,54.3 90.09,54.23
N$6
  Top 0.28: U$1.2 92.28,64.14 92.85,64.14 L4.2
  Top 0.6: C16.2 L6.2 L4.2
N$7
  Top 0.28: U$1.1 91.93,63.64 L4.1
  Top 0.6: L4.1 94.74,60.83 C15.2 95.73,60.74 L5.2
N$8
  Top 0.6: C16.1 97.08,60.8 L5.1 99.03,58.85 C18.1 99.96,57.87 L7.2
N$10
  Top 0.28: U$1.3 94.28,64.64 L6.1
  Top 0.4: L6.1 94.81,64.62 96.26,64.62 C17.2
N$11
  Top 0.6: L7.1 101.64,56.17 C19.1 102.74,54.97 L8.2
N$13
  Top 0.6: L8.1 103.45,54.14 C20.1 C21.2
N$14
  Top 0.2: X4.1 97.5,66.02 92.35,66.02 92.24,66.14 U$1.6
N$15
  Top 0.6: C22.1 NC_R3.2 NC_R3.1 107.06,49.37 C21.1 NC_R2.2
N$16
  Top 0.2: U$1.5 98.18,65.64 98.8,66.26 101.56,66.26 U$2.X2 101.56,67.66 C11.1
N$17
  Top 0.6: 114.75,60.77 NC-U$10.SIGNAL 114.76,60.69 114.76,52.64 112.65,50.53 NC_R2.1
N$18
  Top 0.2: U$11.11 36.33,50.41 L3.1
N$19
  Top 0.2: U$1.23 86.09,71.14 84.64,72.58 C1.1
N$20  (via drill 0.3)
  Top 0.2: U$11.17 46.73,53.81 46.73,53.23 v46.68,53.18
  Top 0.4: 53.05,55.77 NC-JP2.1
  Top 0.406: C36.1 53.05,55.77
  Top 0.8: NC-JP2.1 53.05,50.17 55.05,48.17 U$15.1
  Bottom 0.2: v46.68,53.18 47.8,52.07 NC-JP2.1
N$22
  Top 0.2: U$11.2 39.93,62.71 | 39.93,62.71 R12.2 | NC_R13.1 39.93,62.71
N$23
  Top 0.2: U$11.13 39.53,51.91 42.33,49.11 L2.1
N$25  (via drill 0.3)
  Top 0.15: R10.1 32.85,70.84 34.25,70.84 34.28,70.87 v34.28,70.77 | J1.D+ 34.04,77.29 34.05,77.29 34.28,77.07 34.28,75.17 v34,75.17 33.55,74.72 C34.1
  Bottom 0.15: v34.28,70.77 34.28,75.17 v34,75.17
N$27
  Top 0.2: U$11.14 39.93,52.41 41.43,50.91 R8.1
N$28
  Top 0.2: R8.2 47.52,50.91 LED1.C
N$29
  Top 0.2: U$11.9 37.73,53.81 37.33,53.41 35.7,53.41 R11.2
N$30  (via drill 0.3)
  Top 0.2: U$11.1 40.33,58.91 v40.7,59.28 | v39.23,60.42 v39.22,60.41 NC_R14.2 NC_R14.1 39.13,58.19 U$11.4
  Bottom 0.2: v40.7,59.28 39.56,60.42 v39.23,60.42
N$32
  Top 0.15: R9.1 32.85,71.14 33.83,71.14 34.58,71.89 34.58,73.72 | 34.58,73.72 34.58,77.17 34.35,77.39 34.35,77.89 J1.D- | C33.2 34.58,73.72
N$33
  Top 0.2: R14.2 99.45,88.13 99.79,87.79 25AA1024T.7
N$35
  Top 0.2: U$1.32 arc-90 84.83,65.6 84.75,65.68 X5.1
N$36
  Top 0.2: U$1.31 X6.1
N$37  (via drill 0.3)
  Top 0.2: v30.5,73.09 29.16,71.75 IC2.10 29.08,72.65 IC2.11 | IC2.20 24.88,69.34 | 24.88,69.34 C32.2 | v25.5,68.47 24.88,69.09 24.88,69.34
  Bottom 0.2: v30.5,73.09 30.13,73.09 v25.5,68.47
N$38
  Top 0.2: R13.2 98.16,87.52 97.17,86.52 25AA1024T.3
N$39
  Top 0.2: IC2.16 23.7,71.75 X17.1 21.75,70.96 NC_R5.1
N$40
  Top 0.2: NC_LED2.A 21.29,69.74 NC_R5.2
N$41
  Top 0.2: U$11.5 38.73,57.49 36.93,59.29 X20.1
N$42
  Bottom 0.4: 92.67,53.54 104.46,53.54 104.46,53.55
N$43
  Bottom 0.4: 92.45,45.85 104.83,45.85 104.83,45.86
N$44
  Bottom 0.4: 92.84,52.24 92.84,47.52 92.85,47.51
N$45
  Bottom 0.4: 104.24,51.79 104.24,47.12 104.23,47.11
N$46
  Bottom 0.4: 93.35,43.75 88.41,32.08
N$47
  Bottom 0.4: 96.03,44.1 93.74,32.51
N$48
  Bottom 0.4: 102.52,44.02 106.7,33.13
N$49
  Bottom 0.4: 99.81,43.67 104.34,32.02
N$50
  Bottom 0.4: 99.13,37.1 98.88,31.09
N$51
  Bottom 0.4: 101.66,54.53 106.69,68.51
N$52
  Bottom 0.4: 99.55,55.57 102.39,67.52
N$53
  Top 0.2: X21.1 U$1.14
N$54
  Top 0.4: R15.1 C36.2
PCB_ANTENNA  (via drill 0.3 pad 1)
  Top 0.6: C22.2 L9.2 107.04,42.63 107.25,42.42
  Top 1: v118.95,36.17 108.4,36.17 107.25,37.32 107.25,42.42 | v113.95,34.17 v118.95,34.17 | v118.95,32.17 v113.95,32.17 | v113.95,30.17 v118.95,30.17 | v118.95,28.17 v113.95,28.17 | v113.95,26.17 v118.95,26.17 | v118.95,24.17 v113.95,24.17 | v113.95,22.17 v118.95,22.17 | v118.95,20.17 v113.95,20.17 | v113.95,18.17 v118.95,18.17
  Bottom 1: v118.95,36.17 117.95,35.17 114.95,35.17 v113.95,34.17 | v118.95,34.17 117.95,33.17 114.95,33.17 v113.95,32.17 | v118.95,32.17 117.95,31.17 114.95,31.17 v113.95,30.17 | v118.95,30.17 117.95,29.17 114.95,29.17 v113.95,28.17 | v118.95,28.17 117.95,27.17 114.95,27.17 v113.95,26.17 | v118.95,26.17 117.95,25.17 114.95,25.17 v113.95,24.17 | v118.95,24.17 117.95,23.17 114.95,23.17 v113.95,22.17 | v118.95,22.17 117.95,21.17 114.95,21.17 v113.95,20.17 | v118.95,20.17 117.95,19.17 114.95,19.17 v113.95,18.17
PROG  (via drill 0.3)
  Top 0.2: R19.2 R20.1 21.7,73.66 20.33,72.29 v20.33,69.15 v20.33,69.14 | U$11.16 42.32,53.41 R2.1 42.81,52.02 49.78,52.02 51.63,53.87 51.63,57.34 47.9,61.07 v47.9,66.42 47.9,68.42 X15.1
  Bottom 0.2: v20.33,69.14 22.48,66.99 47.33,66.99 v47.9,66.42
SD_!CS  (via drill 0.3)
  Top 0.2: NC-SD1.CS 116.8,80.89 v114.32,80.89 | U$1.9 98.82,67.64 v99.98,68.8
  Bottom 0.2: v114.32,80.89 110.64,77.21 110.64,72.91 108.81,71.08 103.66,71.08 101.37,68.79 101.36,68.8 v99.98,68.8
SD_D1
  Top 0.2: 116.76,74.31 116.77,74.32 NC-SD1.DAT1 114.28,74.27 113.17,73.16 113.17,70.8 114.13,69.84 115.34,69.84 NC-R18.2
SD_D2
  Top 0.2: NC-SD1.DAT2 115.25,81.97 113.79,83.43 113.79,86.47 112.97,87.29 NC-R15.2
SPI_CLK  (via drill 0.3)
  Top 0.2: U$1.11 96.14,68.64 v96.88,69.37 | NC-SD1.SCK v109.38,77.57 | v96.88,77.57 v100.79,77.57 v100.79,77.56 102.81,79.58 102.81,86.52 25AA1024T.6
  Bottom 0.2: v96.88,69.37 v96.88,77.57 96.88,80.64 93.95,83.57 85.9,83.57 83.3,86.17 83.3,88.27 U$14.SCK | v100.79,77.56 v109.38,77.56 v109.38,77.57
SPI_MISO  (via drill 0.3)
  Top 0.2: NC-SD1.MISO 112.63,75.37 | 112.63,75.37 v109.35,75.37 | 112.63,75.37 112.61,75.31 112.62,75.29 112.62,70.33 114.27,68.68 115.37,68.68 NC-R21.2 | U$1.10 97.44,68.14 v98.32,69.02
  Bottom 0.2: U$14.MISO 87.33,84.34 94.6,84.34 98.27,80.67 98.27,75.37 | v109.35,75.37 98.27,75.37 | v98.32,69.02 98.32,75.32 98.27,75.37
SPI_MOSI  (via drill 0.3)
  Top 0.2: NC-SD1.MOSI v109.35,79.77 | v94.38,79.76 100.36,79.76 v100.36,79.78 100.36,84.59 25AA1024T.5 | U$1.12 95.03,69.14 v95.34,69.45 | U$14.MOSI 83.66,91.17 93.03,91.17 94.09,90.11 97.02,90.11 97.42,89.71 97.42,88.1 97.12,87.79 25AA1024T.2
  Bottom 0.2: U$14.MOSI 80.83,88.34 80.83,85.49 83.5,82.82 93.65,82.82 95.34,81.13 95.34,79.77 | v94.38,79.76 v94.38,79.77 95.34,79.77 | v100.36,79.78 109.33,79.78 | 109.33,79.78 109.33,79.79 | v95.34,69.45 95.34,79.77 | 109.33,79.78 v109.35,79.78 v109.35,79.77
SWITCH_DISP
  Top 0.2: U$1.36 84.32,63.64 84.1,63.42 84.1,60.17 81.77,57.83 62.22,57.83 59.97,55.59 R3.1
SWITCH_DISP_2  (via drill 0.3)
  Top 0.2: R3.2 v55.69,55.59 55.66,55.61 C35.2 | v37.15,54.22 U$11.8
  Bottom 0.2: v55.69,55.59 38.52,55.59 v37.15,54.22
V_DISP
  Top 0.3: X12.1 36.81,30.48 NC-JP1.3
  Top 0.4: L3.2 36.28,43.91 34.98,43.91 34.98,42.11 C26.1 R5.2 | Q2.E 77,83.67 U$14.VCC1 U$14.VCC0 | 34.98,41.11 R5.2 | NC-JP1.3 36.81,33.16 NC_R15.2 NC_R15.1 36.79,35.57 C28.2 35.69,40.14 R5.2
  Bottom 0.406: NC-JP1.3 36.79,26.78 39.63,23.94 56.55,23.94 59.03,26.42 59.03,75.94 61.73,78.64 73.8,78.64 77,81.84 U$14.VCC1
V_USB  (via drill 0.3)
  Top 0.2: U$11.12 39.13,51.81 v38.63,51.31 39.33,50.61 C29.1 | U$11.18 45.68,54.21 | NC_R13.2 37.83,62.66 37.76,62.66 v37.76,61.24 | 45.68,54.21 C24.2 45.7,56.06 v44.82,56.94 | 45.68,54.21 47.85,54.21 47.89,54.17 LED1.A | R11.1 35.45,51.76 v35.55,51.69
  Bottom 0.2: 38.63,57.42 38.63,59.71 37.76,60.58 v37.76,61.24 | 36.33,55.21 38.54,57.42 38.63,57.42 | 38.63,57.42 44.34,57.42 v44.82,56.94
  Bottom 0.25: v38.63,51.31 36.33,51.31 36.33,51.81 | 36.33,51.81 36.33,55.21 | v35.55,51.69 36.21,51.69 36.33,51.81
VDDR  (via drill 0.3)
  Top 0.2: C9.2 v89.05,58.17 89.59,58.17 U$1.45 | C8.2 91.65,58.12 v91.61,58.17 91.09,58.17 U$1.48
  Top 0.25: 91.15,58.17 v91.61,58.17 | v89.05,58.17 89.55,58.17
  Top 0.28: v76.25,64.47 v76.24,64.46 C7.2 | v76.25,64.47 76.26,64.46 | L1.2 76.25,64.87 v76.25,64.47
  Top 0.3: X14.1 76.25,62.67 v76.25,64.47
  Bottom 0.25: v89.05,58.17 89.09,58.17 v91.61,58.17
  Bottom 0.3: v76.25,64.47 76.25,62.67 83.47,62.67 83.47,58.17 89.09,58.17
VUSB_IN  (via drill 0.3)
  Top 0.2: C31.1 C30.1 28.6,74.77 28.6,73.79 | U$11.20 40.98,55.05 40.98,55.09 | IC2.12 27.68,73.79 28.6,73.79 | 28.6,73.79 v29.45,73.79
  Top 0.3: X10.1 43.65,70.57 43.65,70.85
  Top 0.305: J1.VBUS 35.5,77.22 37.8,77.22 40.2,79.62 v43.65,79.62 43.65,70.85 43.65,59.16 C23.2
  Top 0.406: 40.98,55.09 42.23,56.34 42.23,57.67 42.48,57.92 C23.2
  Bottom 0.2: 36.27,81.37 41.9,81.37 v43.65,79.62 | 36.27,81.37 36.25,81.37 | v29.45,73.79 29.45,76.49 29.46,76.68 36.27,81.37

### Text on the board
Bottom: T / R / O / O / P / E / R / S / 1 / 6
tPlace: Silkscreen: T_PRINT 100 and B_PRINT 101
T_PRINT: TDI | NC | TMS | TDO | TCK | JTAG | GND | 3v3 | !RST | NC | GND | RESET | RXD | TXD | SPI / Flash | MicroSD | V_DISP | GND | S_DISP | VUSB | UART | DM | !Sleep | BOOTLOADER | DP | PROG | FT231X | Lanyard | I2C / Flash | VDDR | TROOPERS 2016 | LTC3554 | CC1310 | For / SMA / Antenna | + | - | For / OnBoard / Antenna | Interface | make the world / a safer place | GND | + | - | 3v3 Disp | 3v3 Main